# Altium project Longboard_32bit_ext.PrjPCB (part 5 of 6)

## Sheet Relay_Driver.SchDoc: Sienci Longboard Ext
size B; Author: AM; CompanyName: Expatria Technologies; DrawnBy: A.Marles; Engineer: AM; Organization: Expatria Technolgoies; Address1: PO Box 2084; Address3: Merritt, BC V1K 1B8; Address4: Canada; DocumentNumber: 10; Revision: B9; SheetNumber: 10; SheetTotal: 27
Used 2 times, as channels Sienci CNC Controller/Additional IO/RL1, Sienci CNC Controller/Additional IO/RL2. Parts and nets are listed once, with the designators drawn on the sheet.
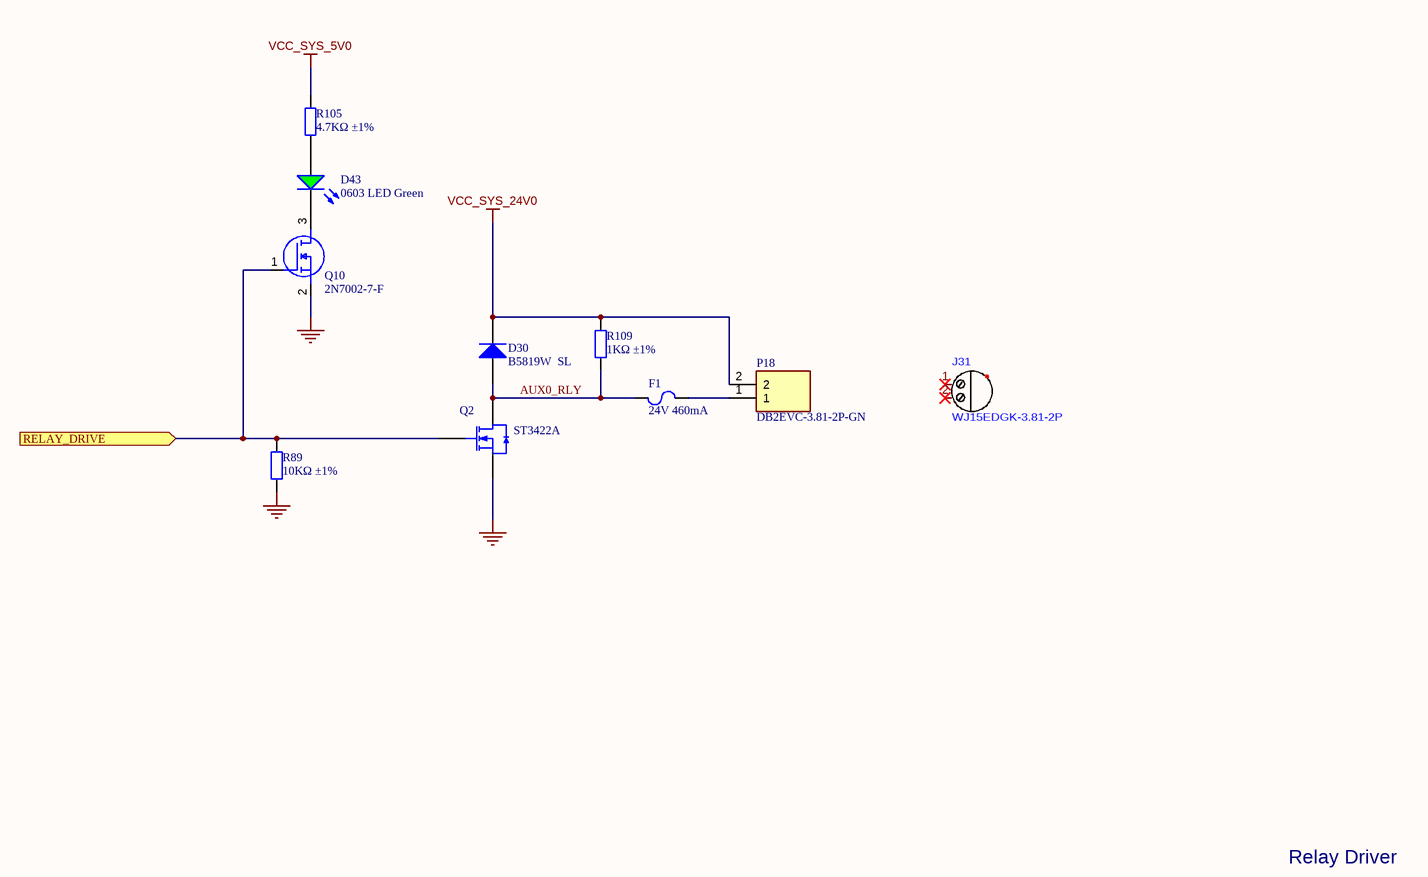
[diagram p18: Relay_Driver.SchDoc]

### Parts
D30  B5819W  SL  [SOD-123]
D43  0603 LED Green  [0603_LED_S1 - GREEN]
F1  24V 460mA  [1206_C]
J31  WJ15EDGK-3.81-2P  (mechanical)
P18  DB2EVC-3.81-2P-GN  [CONN-TH_5P-P3.81_DB2EVC-3.81-2p]
Q2  ST3422A  [SOT-23-3L]
Q10  2N7002-7-F  [SOT-23(SOT-23-3)]
R89  10KΩ ±1%  [0402_R]
R105  4.7KΩ ±1%  [0402_R]
R109  1KΩ ±1%  [0603_R]

### Ports
RELAY_DRIVE (in)

### Nets
GND: Q2.2(S) Q10.2(S) R89.1
VCC_SYS_5V0: R105.2
VCC_SYS_24V0: D30.2(K) P18.2 R109.2
AUX0_RLY: D30.1(A) F1.2 Q2.3(D) R109.1
RELAY_DRIVE: Q2.1(G) Q10.1(G) R89.2 ; port RELAY_DRIVE
NetD43_A: D43.A R105.1
NetD43_K: D43.K Q10.3(D)
NetF1_1: F1.1 P18.1

Not connected (* = marked no-connect by the designer): J31 1* 2*

### Channels
Sienci CNC Controller/Additional IO/RL1: designators end in _RL1; ports RELAY_DRIVE=AUX_OUT_0_5V
Sienci CNC Controller/Additional IO/RL2: designators end in _RL2; ports RELAY_DRIVE=AUX_OUT_1_5V

### Notes on the sheet
- Relay Driver
- SHEET
- Expatria Technologies
- 625 Kane Valley Rd.
- Box 2084
- Merritt, BC V1K1B8
- PROJECT
- SIZE
- ENGR
- MODIFIED
- DOCUMENT
- REV
- Copyright Sienci Labs 2024. This document describes Open Hardware and is licensed under the CERN-OHL-S v2. No warranty is implied or expressed.
- EMAIL: INFO@EXPATRIA.CA
- B
- /

### Library data of the parts
D30 = B5819W  SL: 40V 600mV@1A 1A SOD-123 Schottky Barrier Diodes (SBD) ROHS; Manufacturer: Jiangsu Changjing Electronics Technology Co., Ltd.; ComponentLink1Description: 供应商链接; ComponentLink1URL: http://www.szlcsc.com/product/details_9093.html; Package: SOD-123; Supplier: LC; SuppliersPartNumber: C8598; Manufacturer Part Number: B5819W SL
D43 = MHT192UGCT: 20mA -40℃~+85℃ 515nm~530nm Emerald 120° 60mW 0603 Light Emitting Diodes (LED) ROHS; Manufacturer: MEIHUA; Package: 0603; Supplier: LC; SuppliersPartNumber: C389519; Color: Green; Manufacturer Part Number: MHT192UGCT
F1 = JK-nSMD050-24: 24V 200mA 100A 460mA - Resettable Fuses ROHS; Manufacturer: Jinrui Electronic Materials Co.; PartNumber: JK-nSMD020-24; Package: 1206; Supplier: LC; SuppliersPartNumber: C5307785
J31 = WJ15EDGK-3.81-2P: 2 1 3.81mm Green Plug P=3.81mm Pluggable System Terminal Block ROHS; Manufacturer: Ningbo; Supplier: LCSC; Supplier Part Number 1: C8466; Manufacturer Part Number: WJ15EDGK-3.81-2P; RoHS: Yes; SuppliersPartNumber: C8466
P18 = DB2EVC-3.81-2P-GN: as P1-P4 on sheet Stepper_driver_group; SuppliersPartNumber: C395686; Manufacturer Part Number: DB2EVC-3.81-2P-GN; Supplier: LCSC; Value: DB2EVC-3.81-2P-GN
Q2 = ST3422A: 60V 6A 28mΩ@10V,6A 2W 3V@250uA 38pF@15V N Channel 455pF@15V 10nC@10V -55℃~+150℃@(Tj) SOT-23-3L MOSFETs ROHS; Manufacturer: STANSON Tech.; Package: SOT-23; Supplier: LCSC; SuppliersPartNumber: C2682907; Manufacturer Part Number: ST3422A; Value: ST3422A
Q10 = 2N7002-7-F: 60V 115mA 7.5Ω@5V,50mA 370mW N Channel SOT-23 MOSFETs ROHS; Manufacturer: Diodes Inc.; SuppliersPartNumber: C85049; Manufacturer Part Number: 2N7002-7-F; Value: 2N7002-7-F; Datasheet Link: https://datasheet.datasheetarchive.com/originals/distributors/SFDatasheet-0/sf-0003625.pdf; Height: 1.2mm; Manufacturer_Part_Number: 2N7002-7-F; Mouser Part Number: 621-2N7002-F; Mouser Price/Stock: https://www.mouser.co.uk/ProductDetail/Diodes-Incorporated/2N7002-7-F?qs=jMXWnm70%252BC%252BAX%252BMLzUkTZg%3D%3D; Arrow Part Number: 2N7002-7-F; Arrow Price/Stock: https://www.arrow.com/en/products/2n7002-7-f/diodes-incorporated?region=nac
R89 = 0402 10K (1002) 1%: Chip resistor; Manufacturer: Uniroyal Elec; Manufacturer Part Number: 0402WGF1002TCE; Power: 1/16W; ComponentLink1Description: Supplier link; ComponentLink1URL: http://www.szlcsc.com/product/details_26487.html; Package: 0402; Supplier: LC; SuppliersPartNumber: C25744; Resistance: 10KΩ; Tolerance: 1%
R105 = 0402 4.7K (4701) 1%: Chip resistor; Manufacturer: Uniroyal Elec; Manufacturer Part Number: 0402WGF4701TCE; Power: 1/16W; ComponentLink1Description: Supplier link; ComponentLink1URL: http://www.szlcsc.com/product/details_26643.html; Package: 0402; Supplier: LC; SuppliersPartNumber: C25900; Resistance: 4.7KΩ; Tolerance: 1%
R109 = 0603 1K (1001) 1%: Chip resistor; Manufacturer: Uniroyal Elec; Manufacturer Part Number: 0603WAF1001T5E; Power: 1/10W; ComponentLink1Description: Supplier link; ComponentLink1URL: http://www.szlcsc.com/product/details_21904.html; Package: 0603; Supplier: LC; SuppliersPartNumber: C21190; Resistance: 1KΩ; Tolerance: 1%

## Sheet Neopixel_Driver.SchDoc: Sienci Longboard Ext
size B; Author: AM; CompanyName: Expatria Technologies; DrawnBy: A.Marles; Engineer: AM; Organization: Expatria Technolgoies; Address1: PO Box 2084; Address3: Merritt, BC V1K 1B8; Address4: Canada; DocumentNumber: 11; Revision: B9; SheetNumber: 11; SheetTotal: 27
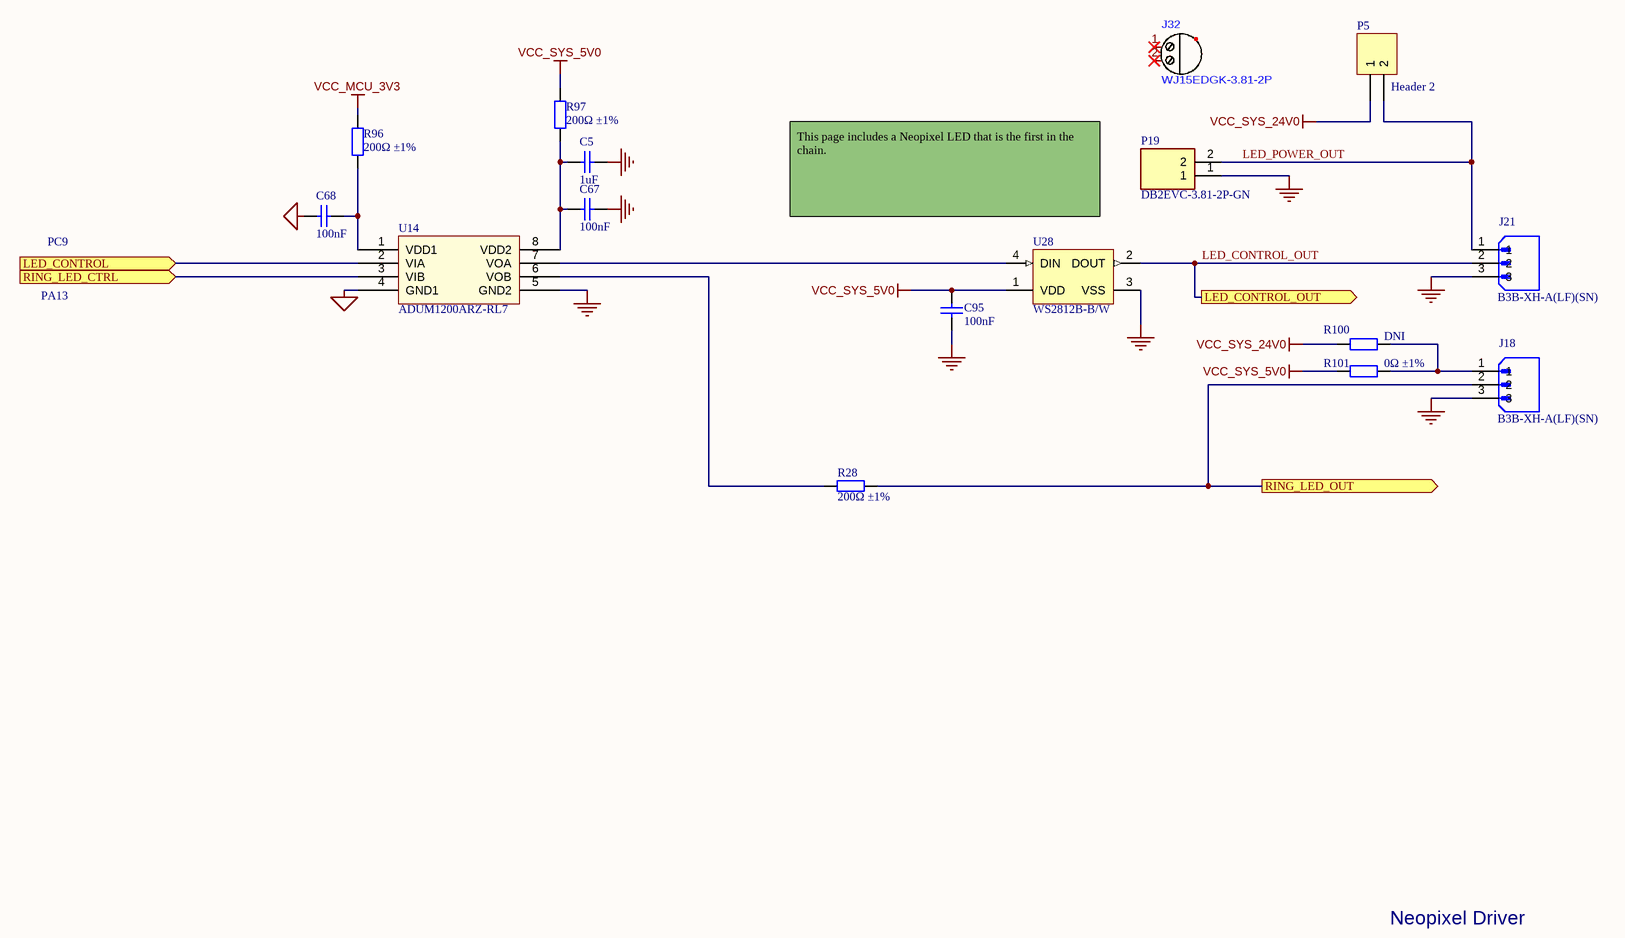
[diagram p19: Neopixel_Driver.SchDoc]

### Parts
C5  1uF  [0603_C]
C67  100nF  [0603_C]
C68  100nF  [0603_C]
C95  100nF  [0603_C]
J18  B3B-XH-A(LF)(SN)  [JST_B3B-XH-A(LF)(SN)]
J21  B3B-XH-A(LF)(SN)  [JST_B3B-XH-A(LF)(SN)]
J32  WJ15EDGK-3.81-2P  (mechanical)
P5  Header 2  [HDR1X2]
P19  DB2EVC-3.81-2P-GN  [CONN-TH_5P-P3.81_DB2EVC-3.81-2p]
R28  200Ω ±1%  [0402_R]
R96  200Ω ±1%  [0402_R]
R97  200Ω ±1%  [0402_R]
R100  DNI  [0603_R]
R101  0Ω ±1%  [0603_R]
U14  ADUM1200ARZ-RL7  [SOIC-8_150mil]
U28  WS2812B-B/W  [ADA-RGB-1655_V]

### Ports
LED_CONTROL (in), LED_CONTROL_OUT (out), RING_LED_CTRL (in), RING_LED_OUT (out)

### Nets
GND: C5.1 C67.1 C95.1 J18.3 J21.3 P19.1 U14.5(GND2) U28.3(VSS)
MCU_GND: C68.2 U14.4(GND1)
VCC_MCU_3V3: R96.2
VCC_SYS_5V0: C95.2 R97.2 R101.2 U28.1(VDD)
VCC_SYS_24V0: P5.1 R100.2
LED Control: U14.2(VIA) ; port LED_CONTROL
LED_CONTROL_OUT: J21.2 U28.2(DOUT) ; port LED_CONTROL_OUT
LED_POWER_OUT: J21.1 P5.2 P19.2
RING_LED_OUT: J18.2 R28.1 ; port RING_LED_OUT
SWDIO: U14.3(VIB) ; port RING_LED_CTRL
NetC5_2: C5.2 C67.2 R97.1 U14.8(VDD2)
NetC68_1: C68.1 R96.1 U14.1(VDD1)
NetJ18_1: J18.1 R100.1 R101.1
NetR28_2: R28.2 U14.6(VOB)
NetU14_7: U14.7(VOA) U28.4(DIN)

Not connected (* = marked no-connect by the designer): J32 1* 2*

### Notes on the sheet
- PC9
- (near U28) This page includes a Neopixel LED that is the first in the chain.
- PA13
- Neopixel Driver
- SHEET
- Expatria Technologies
- 625 Kane Valley Rd.
- Box 2084
- Merritt, BC V1K1B8
- PROJECT
- SIZE
- ENGR
- MODIFIED
- DOCUMENT
- REV
- Copyright Sienci Labs 2024. This document describes Open Hardware and is licensed under the CERN-OHL-S v2. No warranty is implied or expressed.
- EMAIL: INFO@EXPATRIA.CA
- B
- /

### Library data of the parts
C5 = 0603 1uF (105) 10% 50V: Chip capacitors; Manufacturer: Samsung Electro-Mechanics; Manufacturer Part Number: CL10A105KB8NNNC; Tolerance: 10%; Voltage: 50V; Package: 0603; Supplier: LC; SuppliersPartNumber: C15849; Capacitance: 1uF; Manufacturer 1: Samsung Electro-Mechanics
C67 C68 C95 = 0603 100nF (104) 10% 50V: 50V 100nF X7R ±10% 0603 Multilayer Ceramic Capacitors MLCC - SMD/SMT ROHS; Manufacturer: YAGEO; Manufacturer Part Number: CC0603KRX7R9BB104; ComponentLink1Description: Supplier link; ComponentLink1URL: http://www.szlcsc.com/product/details_15331.html; Package: 0603; Supplier: LC; SuppliersPartNumber: C14663; Capacitance: 100nF; Tolerance: 10%; Voltage: 50V
J18 J21 = B3B-XH-A(LF)(SN): Connector Header Through Hole 3 position 0.098" (2.50mm); Manufacturer: JST Sales America; Manufacturer Part Number: B3B-XH-A(LF)(SN); SuppliersPartNumber: C144394; MP: B3B-XH-A(LF)(SN); Value: B3B-XH-A(LF)(SN); Supplier: LCSC
J32 = WJ15EDGK-3.81-2P: as J31 on sheet Relay_Driver; Supplier: LCSC; Supplier Part Number 1: C8466; Manufacturer Part Number: WJ15EDGK-3.81-2P; RoHS: Yes; SuppliersPartNumber: C8466
P5 = Header 2: Straight Square Pins 2 2.54mm Black Brass 1x2P Plugin,P=2.54mm Pin Headers ROHS; Manufacturer: MOLEX; Manufacturer Part Number: 22284020; Publisher: Altium Limited; LatestRevisionDate: 17-Jul-2002; LatestRevisionNote: Re-released for DXP Platform.; SuppliersPartNumber: C234182; Supplier 1: LCSC; Supplier Part Number 1: C234182
P19 = DB2EVC-3.81-2P-GN: as P1-P4 on sheet Stepper_driver_group; SuppliersPartNumber: C395686; Manufacturer Part Number: DB2EVC-3.81-2P-GN; Supplier: LCSC; Value: DB2EVC-3.81-2P-GN
R28 R96 R97 = 0402 200R (2000) 1%: Chip resistor; Manufacturer: Uniroyal Elec; Manufacturer Part Number: 0402WGF2000TCE; Power: 1/16W; ComponentLink1Description: Supplier link; ComponentLink1URL: http://www.szlcsc.com/product/details_25830.html; Package: 0402; Supplier: LC; SuppliersPartNumber: C25087; Resistance: 200Ω; Tolerance: 1%
R100 = 0603 0R (0R0) 1%: Chip resistor; Manufacturer: Uniroyal Elec; Manufacturer Part Number: 0603WAF0000T5E; Power: 1/10W; Resistance: 0Ω; Tolerance: 1%; ComponentLink1Description: Supplier link; ComponentLink1URL: http://www.szlcsc.com/product/details_21903.html; Package: 0603; Supplier: LC; SuppliersPartNumber: C21189
R101 = 0603 0R (0R0) 1%: Chip resistor; Manufacturer: Uniroyal Elec; Manufacturer Part Number: 0603WAF0000T5E; Power: 1/10W; ComponentLink1Description: Supplier link; ComponentLink1URL: http://www.szlcsc.com/product/details_21903.html; Package: 0603; Supplier: LC; SuppliersPartNumber: C21189; Resistance: 0Ω; Tolerance: 1%
U14 = ADUM1200ARZ-RL7: Dual Channel Isolator; Manufacturer: Analog Devices; Package: SOIC-8_150mil; Supplier: LC; SuppliersPartNumber: C15219; ComponentLink1Description: 供应商链接; ComponentLink1URL: http://www.szlcsc.com/product/details_10199.html; Manufacturer Part Number: ADUM1200ARZ-RL7
U28 = WS2812B-B/W: Intelligent Control LED Integrated Light Source, 3.5 to 5.3 V, -25 to 80 degC, 4-Pin SMD, RoHS, Tape and Reel; Manufacturer: Worldsemi; Manufacturer 1: Adafruit Industries; Manufacturer Part Number 1: 1655; Package Description: 4-Pin Surface Mount Device, Body 5 x 5 mm; SuppliersPartNumber: C2761795; Manufacturer Part Number: WS2812B-B/W; Supplier: LCSC

## Sheet Transistor_Driver.SchDoc: Sienci Longboard Ext
size B; Author: AM; CompanyName: Expatria Technologies; DrawnBy: A.Marles; Engineer: AM; Organization: Expatria Technolgoies; Address1: PO Box 2084; Address3: Merritt, BC V1K 1B8; Address4: Canada; DocumentNumber: 15; Revision: B9; SheetNumber: 15; SheetTotal: 27
Used 2 times, as channels Sienci CNC Controller/Additional IO/TR1, Sienci CNC Controller/Additional IO/TR2. Parts and nets are listed once, with the designators drawn on the sheet.
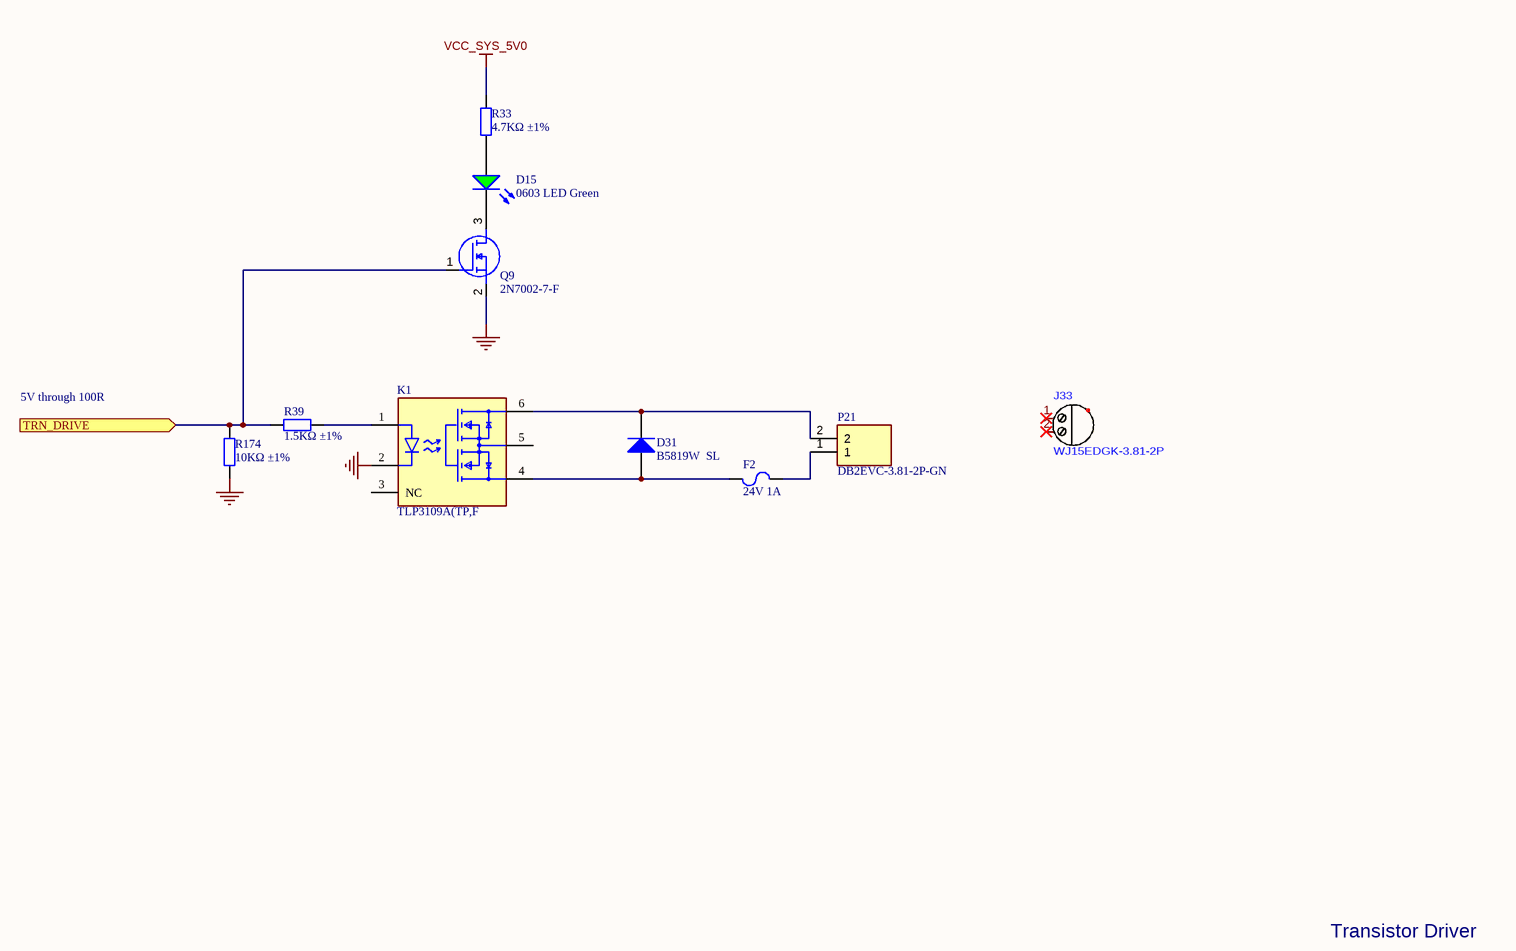
[diagram p20: Transistor_Driver.SchDoc]

### Parts
D15  0603 LED Green  [0603_LED_S1 - GREEN]
D31  B5819W  SL  [SOD-123]
F2  24V 1A  [1206_C]
J33  WJ15EDGK-3.81-2P  (mechanical)
K1  TLP3109A(TP,F  [FP-11-7C1S-MFG]
P21  DB2EVC-3.81-2P-GN  [CONN-TH_5P-P3.81_DB2EVC-3.81-2p]
Q9  2N7002-7-F  [SOT-23(SOT-23-3)]
R33  4.7KΩ ±1%  [0402_R]
R39  1.5KΩ ±1%  [0402_R]
R174  10KΩ ±1%  [0402_R]

### Ports
TRN_DRIVE (in)

### Nets
GND: K1.2(C) Q9.2(S) R174.1
VCC_SYS_5V0: R33.2
TRN_DRIVE: Q9.1(G) R39.1 R174.2 ; port TRN_DRIVE
NetD15_A: D15.A R33.1
NetD15_K: D15.K Q9.3(D)
NetD31_1: D31.1(A) F2.1 K1.4(Drain)
NetD31_2: D31.2(K) K1.6(Drain) P21.2
NetF2_2: F2.2 P21.1
NetK1_1: K1.1(A) R39.2

Not connected (* = marked no-connect by the designer): J33 1* 2*; K1 3(NC) 5(Source)

### Channels
Sienci CNC Controller/Additional IO/TR1: designators end in _TR1; ports TRN_DRIVE=AUX_OUT_2_5V
Sienci CNC Controller/Additional IO/TR2: designators end in _TR2; ports TRN_DRIVE=AUX_OUT_3_5V

### Notes on the sheet
- 5V through 100R
- Transistor Driver
- SHEET
- Expatria Technologies
- 625 Kane Valley Rd.
- Box 2084
- Merritt, BC V1K1B8
- PROJECT
- SIZE
- ENGR
- MODIFIED
- DOCUMENT
- REV
- Copyright Sienci Labs 2024. This document describes Open Hardware and is licensed under the CERN-OHL-S v2. No warranty is implied or expressed.
- EMAIL: INFO@EXPATRIA.CA
- B
- /

### Library data of the parts
D15 = MHT192UGCT: as D43 on sheet Relay_Driver; Package: 0603; Supplier: LC; SuppliersPartNumber: C389519; Color: Green; Manufacturer Part Number: MHT192UGCT
D31 = B5819W  SL: as D30 on sheet Relay_Driver; ComponentLink1Description: 供应商链接; ComponentLink1URL: http://www.szlcsc.com/product/details_9093.html; Package: SOD-123; Supplier: LC; SuppliersPartNumber: C8598; Manufacturer Part Number: B5819W SL
F2 = JK-nSMD050-24: 24V 1A 0.1s 1206 PTC Resettable Fuses RoHS; Manufacturer: Jinrui Electronic Materials Co.; Package: 1206; Supplier: LC; SuppliersPartNumber: C369160; PartNumber: JK-nSMD050-24
J33 = WJ15EDGK-3.81-2P: as J31 on sheet Relay_Driver; Supplier: LCSC; Supplier Part Number 1: C8466; Manufacturer Part Number: WJ15EDGK-3.81-2P; RoHS: Yes; SuppliersPartNumber: C8466
K1 = TLP3109A(TP,F: Relay SSR 10mA 1.8V DC-IN 3A 100V DC-OUT 6-Pin 11-7C1S Emboss T/R; Manufacturer: Toshiba; Manufacturer Part Number: TLP3109A(TP,F; SuppliersPartNumber: C1857559; Supplier: LC; Supplier 1: Digikey; Supplier Part Number 1: 264-TLP3109A(TPFCT-ND; RoHS: No; Category: Solid State Relays
P21 = DB2EVC-3.81-2P-GN: as P1-P4 on sheet Stepper_driver_group; SuppliersPartNumber: C395686; Manufacturer Part Number: DB2EVC-3.81-2P-GN; Supplier: LCSC; Value: DB2EVC-3.81-2P-GN
Q9 = 2N7002-7-F: as Q10 on sheet Relay_Driver; SuppliersPartNumber: C85049; Manufacturer Part Number: 2N7002-7-F; Value: 2N7002-7-F; Datasheet Link: https://datasheet.datasheetarchive.com/originals/distributors/SFDatasheet-0/sf-0003625.pdf; Height: 1.2mm; Manufacturer_Part_Number: 2N7002-7-F; Mouser Part Number: 621-2N7002-F; Mouser Price/Stock: https://www.mouser.co.uk/ProductDetail/Diodes-Incorporated/2N7002-7-F?qs=jMXWnm70%252BC%252BAX%252BMLzUkTZg%3D%3D; Arrow Part Number: 2N7002-7-F; Arrow Price/Stock: https://www.arrow.com/en/products/2n7002-7-f/diodes-incorporated?region=nac
R33 = 0402 4.7K (4701) 1%: as R105 on sheet Relay_Driver; ComponentLink1Description: Supplier link; ComponentLink1URL: http://www.szlcsc.com/product/details_26643.html; Package: 0402; Supplier: LC; SuppliersPartNumber: C25900; Resistance: 4.7KΩ; Tolerance: 1%
R39 = 0402 1.5K (1501) 1%: Chip resistor; Manufacturer: Uniroyal Elec; Manufacturer Part Number: 0402WGF1501TCE; Power: 1/16W; ComponentLink1Description: Supplier link; ComponentLink1URL: http://www.szlcsc.com/product/details_26610.html; Package: 0402; Supplier: LC; SuppliersPartNumber: C25867; Resistance: 1.5KΩ; Tolerance: 1%
R174 = 0402 10K (1002) 1%: as R89 on sheet Relay_Driver; ComponentLink1Description: Supplier link; ComponentLink1URL: http://www.szlcsc.com/product/details_26487.html; Package: 0402; Supplier: LC; SuppliersPartNumber: C25744; Resistance: 10KΩ; Tolerance: 1%

## Sheet External_Stepper.SchDoc: Sienci Longboard Ext
size B; Author: AM; CompanyName: Expatria Technologies; DrawnBy: A.Marles; Engineer: AM; Organization: Expatria Technolgoies; Address1: PO Box 2084; Address3: Merritt, BC V1K 1B8; Address4: Canada; DocumentNumber: 12; Revision: B9; SheetNumber: 12; SheetTotal: 27
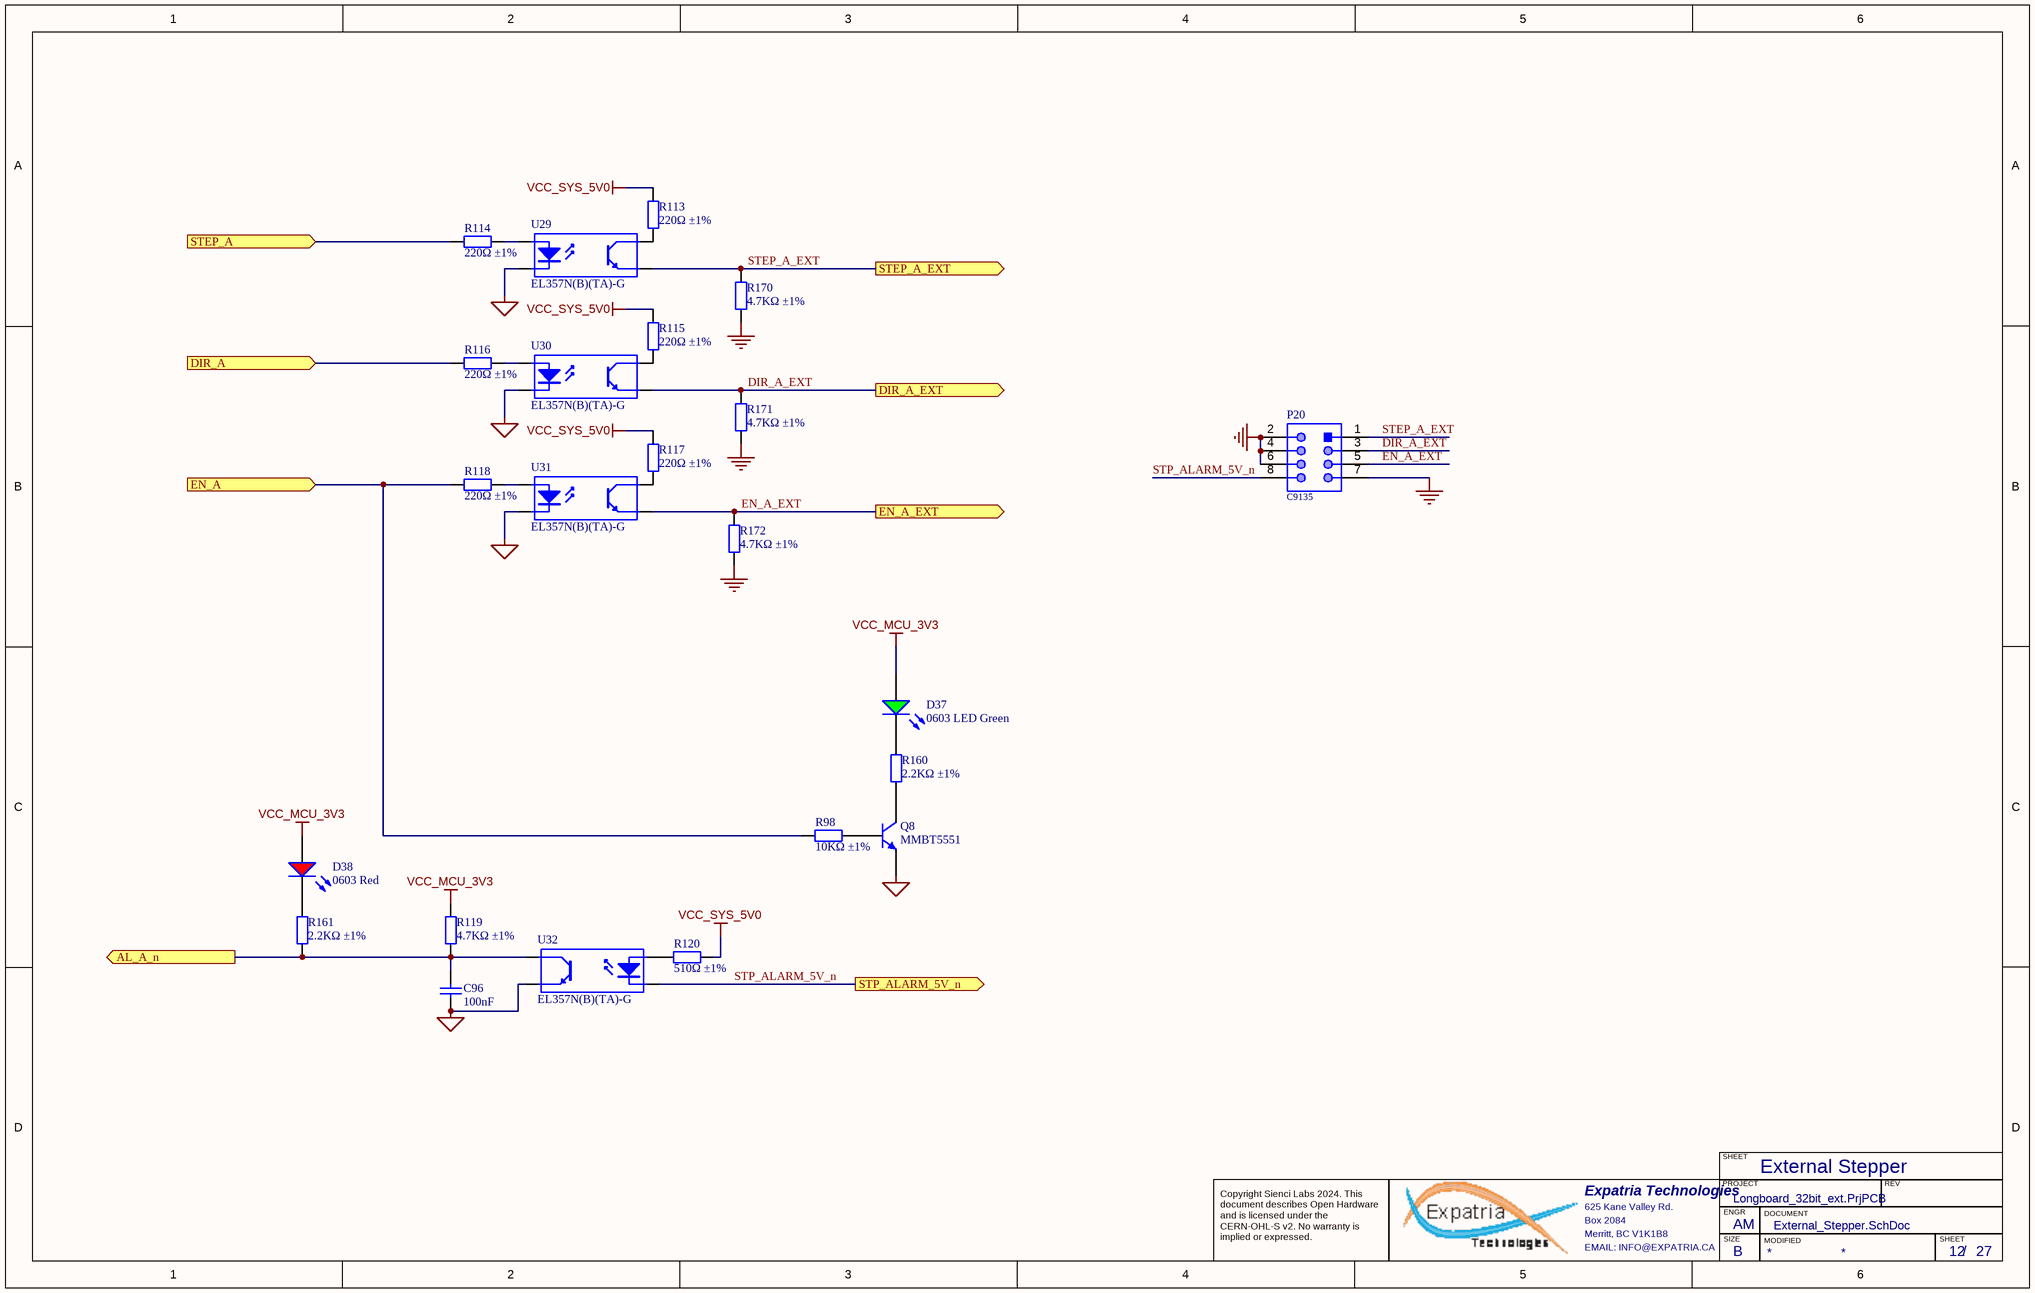
[diagram p21: External_Stepper.SchDoc]

### Parts
C96  100nF  [0402_C]
D37  0603 LED Green  [0603_LED_S1 - GREEN]
D38  0603 Red  [0603_LED_S1]
P20  C9135  [61200821621]
Q8  MMBT5551  [SOT-23(SOT-23-3)]
R98  10KΩ ±1%  [0603_R]
R113  220Ω ±1%  [0402_R]
R114  220Ω ±1%  [0402_R]
R115  220Ω ±1%  [0402_R]
R116  220Ω ±1%  [0402_R]
R117  220Ω ±1%  [0402_R]
R118  220Ω ±1%  [0402_R]
R119  4.7KΩ ±1%  [0402_R]
R120  510Ω ±1%  [0402_R]
R160  2.2KΩ ±1%  [0402_R]
R161  2.2KΩ ±1%  [0402_R]
R170  4.7KΩ ±1%  [0402_R]
R171  4.7KΩ ±1%  [0402_R]
R172  4.7KΩ ±1%  [0402_R]
U29  EL357N(B)(TA)-G  [SOP-4_P2.54]
U30  EL357N(B)(TA)-G  [SOP-4_P2.54]
U31  EL357N(B)(TA)-G  [SOP-4_P2.54]
U32  EL357N(B)(TA)-G  [SOP-4_P2.54]

### Ports
AL_A_n (out), DIR_A (in), DIR_A_EXT (out), EN_A (in), EN_A_EXT (out), STEP_A (in), STEP_A_EXT (out), STP_ALARM_5V_n (out)

### Nets
GND: P20.2 P20.4 P20.6 P20.7 R170.2 R171.2 R172.2
MCU_GND: C96.1 Q8.2(E) U29.2(K) U30.2(K) U31.2(K) U32.3(E)
VCC_MCU_3V3: D37.A D38.A R119.2
VCC_SYS_5V0: R113.1 R115.1 R117.1 R120.2
AL_A: C96.2 R119.1 R161.1 U32.4(C) ; port AL_A_n
DIR_A: R116.1 ; port DIR_A
DIR_A_EXT: P20.3 R171.1 U30.3(E) ; port DIR_A_EXT
EN_A_EXT: P20.5 R172.1 U31.3(E) ; port EN_A_EXT
STEP_A: R114.1 ; port STEP_A
STEP_A_EXT: P20.1 R170.1 U29.3(E) ; port STEP_A_EXT
STEP_EN_A: R98.2 R118.1 ; port EN_A
STP_ALARM_5V_n: P20.8 U32.2(K) ; port STP_ALARM_5V_n
NetD37_K: D37.K R160.2
NetD38_K: D38.K R161.2
NetQ8_1: Q8.1(B) R98.1
NetQ8_3: Q8.3(C) R160.1
NetR113_2: R113.2 U29.4(C)
NetR114_2: R114.2 U29.1(A)
NetR115_2: R115.2 U30.4(C)
NetR116_2: R116.2 U30.1(A)
NetR117_2: R117.2 U31.4(C)
NetR118_2: R118.2 U31.1(A)
NetR120_1: R120.1 U32.1(A)

### Notes on the sheet
- External Stepper
- SHEET
- Expatria Technologies
- 625 Kane Valley Rd.
- Box 2084
- Merritt, BC V1K1B8
- PROJECT
- SIZE
- ENGR
- MODIFIED
- DOCUMENT
- REV
- Copyright Sienci Labs 2024. This document describes Open Hardware and is licensed under the CERN-OHL-S v2. No warranty is implied or expressed.
- EMAIL: INFO@EXPATRIA.CA
- B
- /

### Library data of the parts
C96 = 0402 100nF (104) 10% 16V: 16V 100nF X7R ±10% 0402 Multilayer Ceramic Capacitors MLCC - SMD/SMT ROHS; Manufacturer: Samsung Electro-Mechanics; Manufacturer Part Number: CL05B104KO5NNNC; ComponentLink1Description: Supplier link; ComponentLink1URL: http://www.szlcsc.com/product/details_1877.html; Package: 0402; Supplier: LC; SuppliersPartNumber: C1525; Capacitance: 100nF; Tolerance: 10%; Voltage: 16V
D37 = MHT192UGCT: as D43 on sheet Relay_Driver; Package: 0603; Supplier: LC; SuppliersPartNumber: C389519; Color: Green; Manufacturer Part Number: MHT192UGCT
D38 = KT-0603R: as D61-D64 on sheet Stepper_driver_group; Package: 0603; Supplier: LC; SuppliersPartNumber: C2286; Color: Red; Manufacturer Part Number: KT-0603R; Value: 0603 Red
P20 = HDR2x4P: Male Box Header WR-BHD, THT, Vertical, pitch 2.54 mm, 8 pins; Manufacturer: Wurth Electronics; Pitch: 2.54mm; Publisher: WurthElektronik; Manufacturer Part Number: C9135; Packaging: Tray; Published Date: August2018; Manufacturer Part Number: 61200821621; SuppliersPartNumber: C9135; Supplier: LCSC
Q8 = MMBT5551: 50nA 160V 300mW 200@10mA,5V 600mA 100MHz 200mV@50mA,5mA NPN +150℃@(Tj) SOT-23-3 Bipolar Transistors - BJT ROHS; Manufacturer: Jiangsu Changjing Electronics Technology; Package: SOT-23; Supplier: LCSC; SuppliersPartNumber: C2145; Manufacturer Part Number: MMBT5551; Value: MMBT5551
R98 = 0603 10K (1002) 1%: Chip resistor; Manufacturer: Uniroyal Elec; Manufacturer Part Number: 0603WAF1002T5E; Power: 1/10W; Package: 0603; Supplier: LC; SuppliersPartNumber: C25804; Resistance: 10KΩ; Tolerance: 1%; ComponentLink1Description: Supplier link; ComponentLink1URL: http://www.szlcsc.com/product/details_26547.html
R113-R118 = 0402 220R (2200) 1%: Chip resistor; Manufacturer: Uniroyal Elec; Manufacturer Part Number: 0402WGF2200TCE; Power: 1/16W; Package: 0402; Supplier: LC; SuppliersPartNumber: C25091; Resistance: 220Ω; Tolerance: 1%; ComponentLink1Description: Supplier link; ComponentLink1URL: http://www.szlcsc.com/product/details_25834.html
R119 R170-R172 = 0402 4.7K (4701) 1%: as R105 on sheet Relay_Driver; ComponentLink1Description: Supplier link; ComponentLink1URL: http://www.szlcsc.com/product/details_26643.html; Package: 0402; Supplier: LC; SuppliersPartNumber: C25900; Resistance: 4.7KΩ; Tolerance: 1%
R120 = 0402 510R (5100) 1%: Chip resistor; Manufacturer: Uniroyal Elec; Manufacturer Part Number: 0402WGF5100TCE; Power: 1/16W; ComponentLink1Description: Supplier link; ComponentLink1URL: http://www.szlcsc.com/product/details_25866.html; Package: 0402; Supplier: LC; SuppliersPartNumber: C25123; Resistance: 510Ω; Tolerance: 1%
R160 R161 = 0402 2.2K (2201) 1%: as R185-R188 on sheet Stepper_driver_group; ComponentLink1Description: Supplier link; ComponentLink1URL: http://www.szlcsc.com/product/details_26622.html; Package: 0402; Supplier: LC; SuppliersPartNumber: C25879; Resistance: 2.2KΩ; Tolerance: 1%
U29-U32 = EL357N(B)(TA)-G_[C6649]: Optocoupler SOP-4, EL357N(B)(TA)-G, Everlight Electronics; Package: SOP-4_P2.54; Supplier: LC; SuppliersPartNumber: C6649; Manufacturer: Everlight; Manufacturer Part Number: EL357N(B)(TA)-G

## Sheet 5V_Digital_Out.SchDoc: Sienci Longboard Ext
size B; Author: AM; CompanyName: Expatria Technologies; DrawnBy: A.Marles; Engineer: AM; Organization: Expatria Technolgoies; Address1: PO Box 2084; Address3: Merritt, BC V1K 1B8; Address4: Canada; DocumentNumber: 13; Revision: B9; SheetNumber: 13; SheetTotal: 27
Used 6 times, as channels Sienci CNC Controller/Additional IO/AO0, Sienci CNC Controller/Additional IO/AO1, Sienci CNC Controller/Additional IO/AO2, Sienci CNC Controller/Additional IO/AO3, Sienci CNC Controller/Additional IO/COO, Sienci CNC Controller/Additional IO/MIS. Parts and nets are listed once, with the designators drawn on the sheet.
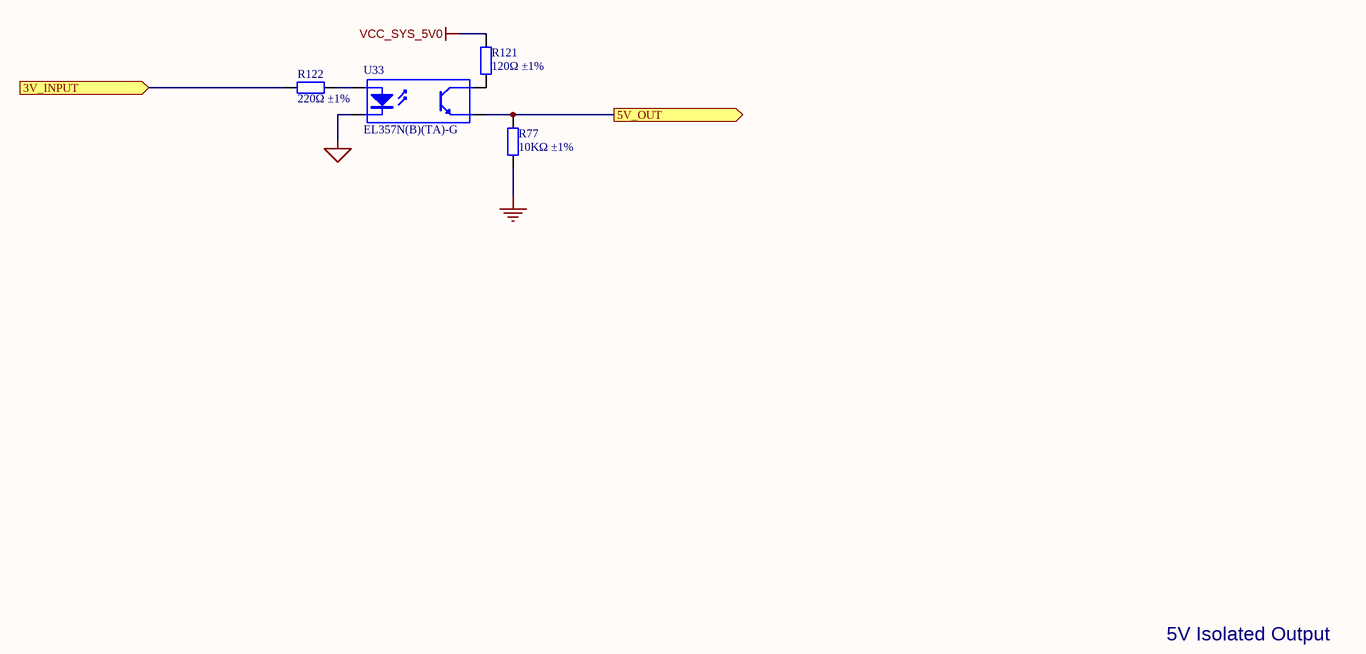
[diagram p22: 5V_Digital_Out.SchDoc]

### Parts
R77  10KΩ ±1%  [0402_R]
R121  120Ω ±1%  [0402_R]
R122  220Ω ±1%  [0402_R]
U33  EL357N(B)(TA)-G  [SOP-4_P2.54]

### Ports
3V_INPUT (in), 5V_OUT (out)

### Nets
GND: R77.1
MCU_GND: U33.2(K)
VCC_SYS_5V0: R121.1
3V_INPUT: R122.1 ; port 3V_INPUT
5V_OUT: R77.2 U33.3(E) ; port 5V_OUT
NetR121_2: R121.2 U33.4(C)
NetR122_2: R122.2 U33.1(A)

### Channels
Sienci CNC Controller/Additional IO/AO0: designators end in _AO0; ports 3V_INPUT=AUXOUT_0 5V_OUT=AUX_OUT_0_5V
Sienci CNC Controller/Additional IO/AO1: designators end in _AO1; ports 3V_INPUT=AUXOUT_1 5V_OUT=AUX_OUT_1_5V
Sienci CNC Controller/Additional IO/AO2: designators end in _AO2; ports 3V_INPUT=AUXOUT_2 5V_OUT=AUX_OUT_2_5V
Sienci CNC Controller/Additional IO/AO3: designators end in _AO3; ports 3V_INPUT=AUXOUT_3 5V_OUT=AUX_OUT_3_5V
Sienci CNC Controller/Additional IO/COO: designators end in _COO; ports 3V_INPUT=COOLANT 5V_OUT=COOLANT_5V
Sienci CNC Controller/Additional IO/MIS: designators end in _MIS; ports 3V_INPUT=MIST 5V_OUT=MIST_5V

### Notes on the sheet
- 5V Isolated Output
- SHEET
- Expatria Technologies
- 625 Kane Valley Rd.
- Box 2084
- Merritt, BC V1K1B8
- PROJECT
- SIZE
- ENGR
- MODIFIED
- DOCUMENT
- REV
- Copyright Sienci Labs 2024. This document describes Open Hardware and is licensed under the CERN-OHL-S v2. No warranty is implied or expressed.
- EMAIL: INFO@EXPATRIA.CA
- B
- /

### Library data of the parts
R77 = 0402 10K (1002) 1%: as R89 on sheet Relay_Driver; ComponentLink1Description: Supplier link; ComponentLink1URL: http://www.szlcsc.com/product/details_26487.html; Package: 0402; Supplier: LC; SuppliersPartNumber: C25744; Resistance: 10KΩ; Tolerance: 1%
R121 = 0402 120R (1200) 1%: Chip resistor; Manufacturer: Uniroyal Elec; Manufacturer Part Number: 0402WGF1200TCE; Power: 1/16W; Package: 0402; Supplier: LC; SuppliersPartNumber: C25079; Resistance: 120Ω; Tolerance: 1%; ComponentLink1Description: Supplier link; ComponentLink1URL: http://www.szlcsc.com/product/details_25822.html
R122 = 0402 220R (2200) 1%: as R113-R118 on sheet External_Stepper; ComponentLink1Description: Supplier link; ComponentLink1URL: http://www.szlcsc.com/product/details_25834.html; Package: 0402; Supplier: LC; SuppliersPartNumber: C25091; Resistance: 220Ω; Tolerance: 1%
U33 = EL357N(B)(TA)-G_[C6649]: as U29 on sheet External_Stepper; Package: SOP-4_P2.54; Supplier: LC; SuppliersPartNumber: C6649; Manufacturer: Everlight; Manufacturer Part Number: EL357N(B)(TA)-G

## Sheet 3V3_Digital_Out.SchDoc: Sienci Longboard Ext
size B; Author: AM; CompanyName: Expatria Technologies; DrawnBy: A.Marles; Engineer: AM; Organization: Expatria Technolgoies; Address1: PO Box 2084; Address3: Merritt, BC V1K 1B8; Address4: Canada; DocumentNumber: 14; Revision: B9; SheetNumber: 14; SheetTotal: 27
Used 4 times, as channels Sienci CNC Controller/Additional IO/N0, Sienci CNC Controller/Additional IO/N1, Sienci CNC Controller/Additional IO/N2, Sienci CNC Controller/Additional IO/N3. Parts and nets are listed once, with the designators drawn on the sheet.
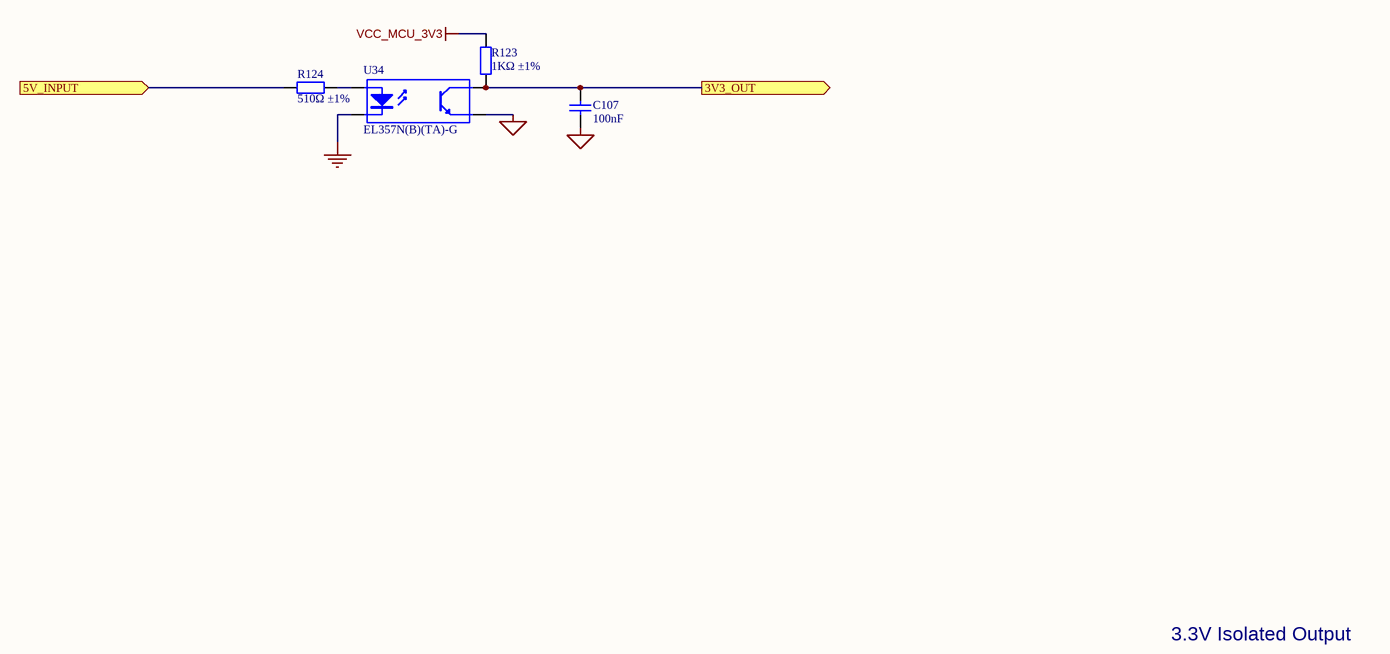
[diagram p23: 3V3_Digital_Out.SchDoc]

### Parts
C107  100nF  [0402_C]
R123  1KΩ ±1%  [0402_R]
R124  510Ω ±1%  [0402_R]
U34  EL357N(B)(TA)-G  [SOP-4_P2.54]

### Ports
3V3_OUT (out), 5V_INPUT (in)

### Nets
GND: U34.2(K)
MCU_GND: C107.1 U34.3(E)
VCC_MCU_3V3: R123.1
3V3_OUT: C107.2 R123.2 U34.4(C) ; port 3V3_OUT
5V_INPUT: R124.1 ; port 5V_INPUT
NetR124_2: R124.2 U34.1(A)

### Channels
Sienci CNC Controller/Additional IO/N0: designators end in _N0; ports 3V3_OUT=AUX_IN_0 5V_INPUT=AUX_IN0_5V
Sienci CNC Controller/Additional IO/N1: designators end in _N1; ports 3V3_OUT=AUX_IN_1 5V_INPUT=AUX_IN1_5V
Sienci CNC Controller/Additional IO/N2: designators end in _N2; ports 3V3_OUT=AUX_IN_2 5V_INPUT=AUX_IN2_5V
Sienci CNC Controller/Additional IO/N3: designators end in _N3; ports 3V3_OUT=AUX_IN_3 5V_INPUT=AUX_IN3_5V

### Notes on the sheet
- 3.3V Isolated Output
- SHEET
- Expatria Technologies
- 625 Kane Valley Rd.
- Box 2084
- Merritt, BC V1K1B8
- PROJECT
- SIZE
- ENGR
- MODIFIED
- DOCUMENT
- REV
- Copyright Sienci Labs 2024. This document describes Open Hardware and is licensed under the CERN-OHL-S v2. No warranty is implied or expressed.
- EMAIL: INFO@EXPATRIA.CA
- B
- /

### Library data of the parts
C107 = 0402 100nF (104) 10% 16V: as C96 on sheet External_Stepper; ComponentLink1Description: Supplier link; ComponentLink1URL: http://www.szlcsc.com/product/details_1877.html; Package: 0402; Supplier: LC; SuppliersPartNumber: C1525; Capacitance: 100nF; Tolerance: 10%; Voltage: 16V
R123 = 0402 1K (1001) 1%: Chip resistor; Manufacturer: Uniroyal Elec; Manufacturer Part Number: 0402WGF1001TCE; Power: 1/16W; Package: 0402; Supplier: LC; SuppliersPartNumber: C11702; Resistance: 1KΩ; Tolerance: 1%; ComponentLink1Description: Supplier link; ComponentLink1URL: http://www.szlcsc.com/product/details_12256.html
R124 = 0402 510R (5100) 1%: as R120 on sheet External_Stepper; ComponentLink1Description: Supplier link; ComponentLink1URL: http://www.szlcsc.com/product/details_25866.html; Package: 0402; Supplier: LC; SuppliersPartNumber: C25123; Resistance: 510Ω; Tolerance: 1%
U34 = EL357N(B)(TA)-G_[C6649]: as U29 on sheet External_Stepper; Package: SOP-4_P2.54; Supplier: LC; SuppliersPartNumber: C6649; Manufacturer: Everlight; Manufacturer Part Number: EL357N(B)(TA)-G

## Sheet CANBUS_Pendant.SchDoc: RP2040 CNC
size B; Author: AM; CompanyName: Expatria Technologies; DrawnBy: A.Marles; Engineer: AM; Organization: Expatria Technolgoies; Address1: PO Box 2084; Address3: Merritt, BC V1K 1B8; Address4: Canada; DocumentNumber: 24; Revision: B9; SheetNumber: 24; SheetTotal: 27
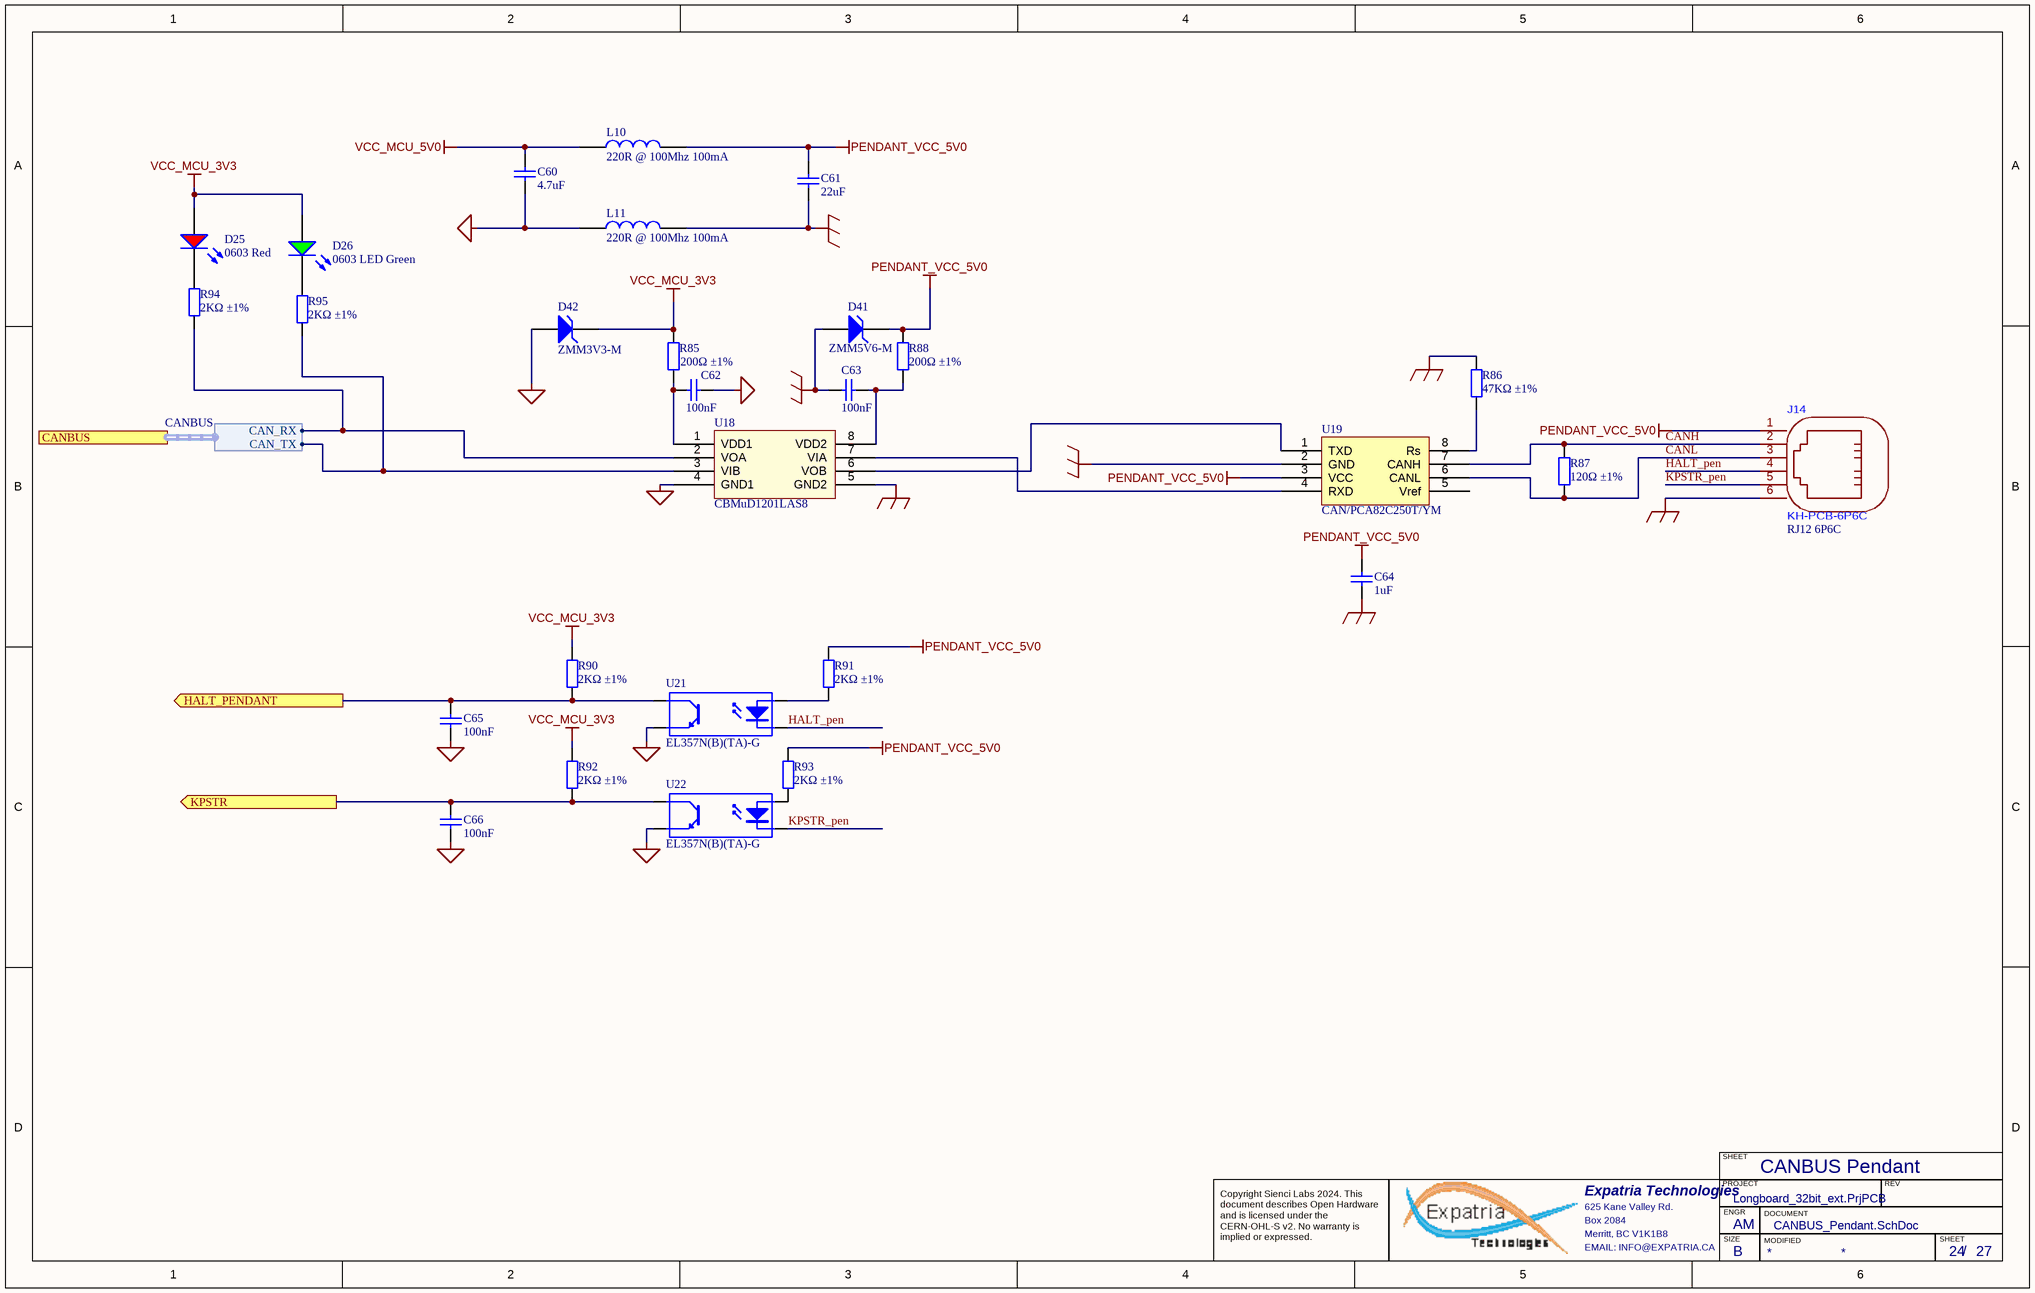
[diagram p24: CANBUS_Pendant.SchDoc]

### Parts
C60  4.7uF  [0805_C]
C61  22uF  [0805_C]
C62  100nF  [0402_C]
C63  100nF  [0402_C]
C64  1uF  [0603_C]
C65  100nF  [0603_C]
C66  100nF  [0603_C]
D25  0603 Red  [0603_LED_S1]
D26  0603 LED Green  [0603_LED_S1 - GREEN]
D41  ZMM5V6-M  [LL-34]
D42  ZMM3V3-M  [LL-34]
J14  KH-PCB-6P6C  value RJ12 6P6C  [RJ11-TH_DS1133-S60BPX]
L10  220R @ 100Mhz 100mA  [0402_L]
L11  220R @ 100Mhz 100mA  [0402_L]
R85  200Ω ±1%  [0402_R]
R86  47KΩ ±1%  [0402_R]
R87  120Ω ±1%  [0805_R]
R88  200Ω ±1%  [0402_R]
R90  2KΩ ±1%  [0402_R]
R91  2KΩ ±1%  [0402_R]
R92  2KΩ ±1%  [0402_R]
R93  2KΩ ±1%  [0402_R]
R94  2KΩ ±1%  [0402_R]
R95  2KΩ ±1%  [0402_R]
U18  CBMuD1201LAS8  [SOIC-8_150mil]
U19  CAN/PCA82C250T/YM  [SOIC-8_150mil]
U21  EL357N(B)(TA)-G  [SOP-4_P2.54]
U22  EL357N(B)(TA)-G  [SOP-4_P2.54]

### Ports
CANBUS (harness CANBUS), HALT_PENDANT (out), KPSTR (out)

### Harnesses
CANBUS: CAN_TX, CAN_RX

### Nets
MCU_GND: C60.1 C62.2 C65.1 C66.1 D42.1(A) L11.1 U18.4(GND1) U21.3(E) U22.3(E)
PEND_GND: C61.1 C63.1 C64.1 D41.1(A) J14.6(NC) L11.2 R86.2 U18.5(GND2) U19.2(GND)
PENDANT_VCC_5V0: C61.2 C64.2 D41.2(K) J14.1(MCLR) L10.2 R88.2 R91.2 R93.2 U19.3(VCC)
VCC_MCU_3V3: D25.A D26.A D42.2(K) R85.2 R90.2 R92.2
VCC_MCU_5V0: C60.2 L10.1
CAN_RX: R94.1 U18.2(VOA) ; port CANBUS.CAN_RX
CAN_TX: R95.1 U18.3(VIB) ; port CANBUS.CAN_TX
CANH: J14.2(VDD) R87.2 U19.7(CANH)
CANL: J14.3(VSS) R87.1 U19.6(CANL)
HALT_pen: J14.4(PGD) U21.2(K)
HALT_PENDANT: C65.2 R90.1 U21.4(C) ; port HALT_PENDANT
KPSTR: C66.2 R92.1 U22.4(C) ; port KPSTR
KPSTR_pen: J14.5(PGC) U22.2(K)
NetC62_1: C62.1 R85.1 U18.1(VDD1)
NetC63_2: C63.2 R88.1 U18.8(VDD2)
NetD25_K: D25.K R94.2
NetD26_K: D26.K R95.2
NetR86_1: R86.1 U19.8(Rs)
NetR91_1: R91.1 U21.1(A)
NetR93_1: R93.1 U22.1(A)
NetU18_6: U18.6(VOB) U19.1(TXD)
NetU18_7: U18.7(VIA) U19.4(RXD)

Not connected (* = marked no-connect by the designer): U19 5(Vref)

### Notes on the sheet
- CANBUS Pendant
- SHEET
- Expatria Technologies
- 625 Kane Valley Rd.
- Box 2084
- Merritt, BC V1K1B8
- PROJECT
- SIZE
- ENGR
- MODIFIED
- DOCUMENT
- REV
- Copyright Sienci Labs 2024. This document describes Open Hardware and is licensed under the CERN-OHL-S v2. No warranty is implied or expressed.
- EMAIL: INFO@EXPATRIA.CA
- B
- /

### Library data of the parts
C60 = 0805 4.7uF (475) 10% 25V: Chip capacitors; Manufacturer: Samsung Electro-Mechanics; Manufacturer Part Number: CL21A475KAQNNNE; Tolerance: 10%; Voltage: 25V; ComponentLink1Description: Supplier link; ComponentLink1URL: http://www.szlcsc.com/product/details_2131.html; Package: 0805; Supplier: LCSC; SuppliersPartNumber: C1779; Capacitance: 4.7uF
C61 = 0805 22uF (226) 20% 25V: 25V 22uF X5R ±20% 0805 Multilayer Ceramic Capacitors MLCC - SMD/SMT ROHS; Manufacturer: Samsung Electro-Mechanics; Manufacturer Part Number: CL21A226MAQNNNE; ComponentLink1Description: Supplier link; ComponentLink1URL: http://www.szlcsc.com/product/details_46786.html; Package: 0805; Supplier: LC; SuppliersPartNumber: C45783; Capacitance: 22uF; Tolerance: 20%; Voltage: 25V
C62 C63 = 0402 100nF (104) 10% 16V: as C96 on sheet External_Stepper; ComponentLink1Description: Supplier link; ComponentLink1URL: http://www.szlcsc.com/product/details_1877.html; Package: 0402; Supplier: LC; SuppliersPartNumber: C1525; Capacitance: 100nF; Tolerance: 10%; Voltage: 16V
C64 = 0603 1uF (105) 10% 50V: as C5 on sheet Neopixel_Driver; ComponentLink1Description: Supplier link; ComponentLink1URL: http://www.szlcsc.com/product/details_16531.html; Package: 0603; Supplier: LCSC; SuppliersPartNumber: C15849; Capacitance: 1uF
C65 C66 = 0603 100nF (104) 10% 50V: as C67 on sheet Neopixel_Driver; ComponentLink1Description: Supplier link; ComponentLink1URL: http://www.szlcsc.com/product/details_15331.html; Package: 0603; Supplier: LC; SuppliersPartNumber: C14663; Capacitance: 100nF; Tolerance: 10%; Voltage: 50V
D25 = KT-0603R: as D61-D64 on sheet Stepper_driver_group; Package: 0603; Supplier: LC; SuppliersPartNumber: C2286; Color: Red; Manufacturer Part Number: KT-0603R; Value: 0603 Red
D26 = MHT192UGCT: as D43 on sheet Relay_Driver; Package: 0603; Supplier: LC; SuppliersPartNumber: C389519; Color: Green; Manufacturer Part Number: MHT192UGCT
D41 = LL-34 ZMM5V6-M: Single 500mW 5.2V~6V 5.6V LL-34 Zener Diodes ROHS; Manufacturer Part Number: ZMM5V6; Manufacturer: HXY MOSFET; Package: LL-34; Supplier: LC; SuppliersPartNumber: C5345993
D42 = LL-34 ZMM3V3-M: Single 3.1V~3.5V 500mW 3.3V LL-34 Zener Diodes ROHS; Manufacturer: ST(Semtech); ComponentLink1Description: 供应商链接; ComponentLink1URL: http://www.szlcsc.com/product/details_8541.html; Package: LL-34; Supplier: LC; SuppliersPartNumber: C8056; Manufacturer Part Number: ZMM3V3-M
J14 = KH-PCB-6P6C: RJ45 RJReceptacle No 1 Shrouded Without LED -45℃~+85℃ Plugin Ethernet Connectors/Modular Connectors (RJ45 RJ11) ROHS; Manufacturer: Shenzhen Kinghelm Elec; Manufacturer Part Number: KH-PCB-6P6C; SuppliersPartNumber: C2683354; Supplier: LCSC
L10 L11 = 0402 220R@100Mhz 0.1A: 700mΩ ±25% 220Ω@100MHz 0402 Ferrite Beads ROHS; Manufacturer Part Number: CBG100505U221T; Manufacturer: FH (Guangdong Fenghua Advanced Tech); Package: 0402; Supplier: LC; SuppliersPartNumber: C92617
R85 R88 = 0402 200R (2000) 1%: as R28 on sheet Neopixel_Driver; ComponentLink1Description: Supplier link; ComponentLink1URL: http://www.szlcsc.com/product/details_25830.html; Package: 0402; Supplier: LC; SuppliersPartNumber: C25087; Resistance: 200Ω; Tolerance: 1%
R86 = 0402 47K (4702) 1%: Chip resistor; Manufacturer: Uniroyal Elec; Manufacturer Part Number: 0402WGF4702TCE; Power: 1/16W; ComponentLink1Description: Supplier link; ComponentLink1URL: http://www.szlcsc.com/product/details_26535.html; Package: 0402; Supplier: LCSC; SuppliersPartNumber: C25792; Resistance: 47KΩ; Tolerance: 1%
R87 = 0805 120R (1200) 1%: Chip resistor; Manufacturer: Uniroyal Elec; Manufacturer Part Number: 0805W8F1200T5E; Power: 1/8W; ComponentLink1Description: Supplier link; ComponentLink1URL: http://www.szlcsc.com/product/details_18125.html; Package: 0805; Supplier: LCSC; SuppliersPartNumber: C17437; Tolerance: 1%
R90-R95 = 0402 2K (2001) 1%: Chip resistor; Manufacturer: Uniroyal Elec; Manufacturer Part Number: 0402WGF2001TCE; Power: 1/16W; ComponentLink1Description: Supplier link; ComponentLink1URL: http://www.szlcsc.com/product/details_4516.html; Package: 0402; Supplier: LC; SuppliersPartNumber: C4109; Resistance: 2KΩ; Tolerance: 1%
U18 = CBMuD1201LAS8: Dual Channel Isolator; Manufacturer: Corebai Microelectronics; Package: SOIC-8_150mil; Supplier: LC; SuppliersPartNumber: C476472; ComponentLink1Description: 供应商链接; ComponentLink1URL: http://www.szlcsc.com/product/details_10199.html; Manufacturer Part Number: CBMuD1201LAS8
U19 = CAN/PCA82C250T/YM_[C7439]: CAN; Manufacturer Part Number: PCA82C250T/YM,118; Manufacturer: NXP Semicon; ComponentLink1Description: 供应商链接; ComponentLink1URL: http://www.szlcsc.com/product/details_7916.html; Package: SOIC-8_150mil; Supplier: LCSC; SuppliersPartNumber: C7439
U21 U22 = EL357N(B)(TA)-G_[C6649]: as U29 on sheet External_Stepper; Package: SOP-4_P2.54; Supplier: LC; SuppliersPartNumber: C6649; Manufacturer: Everlight; Manufacturer Part Number: EL357N(B)(TA)-G

## Sheet Change Log.SchDoc: Sienci Longboard Ext
size B; Author: AM; CompanyName: Expatria Technologies; DrawnBy: A.Marles; Engineer: AM; Organization: Expatria Technolgoies; Address1: PO Box 2084; Address3: Merritt, BC V1K 1B8; Address4: Canada; DocumentNumber: 27; Revision: B9; SheetNumber: 27; SheetTotal: 27
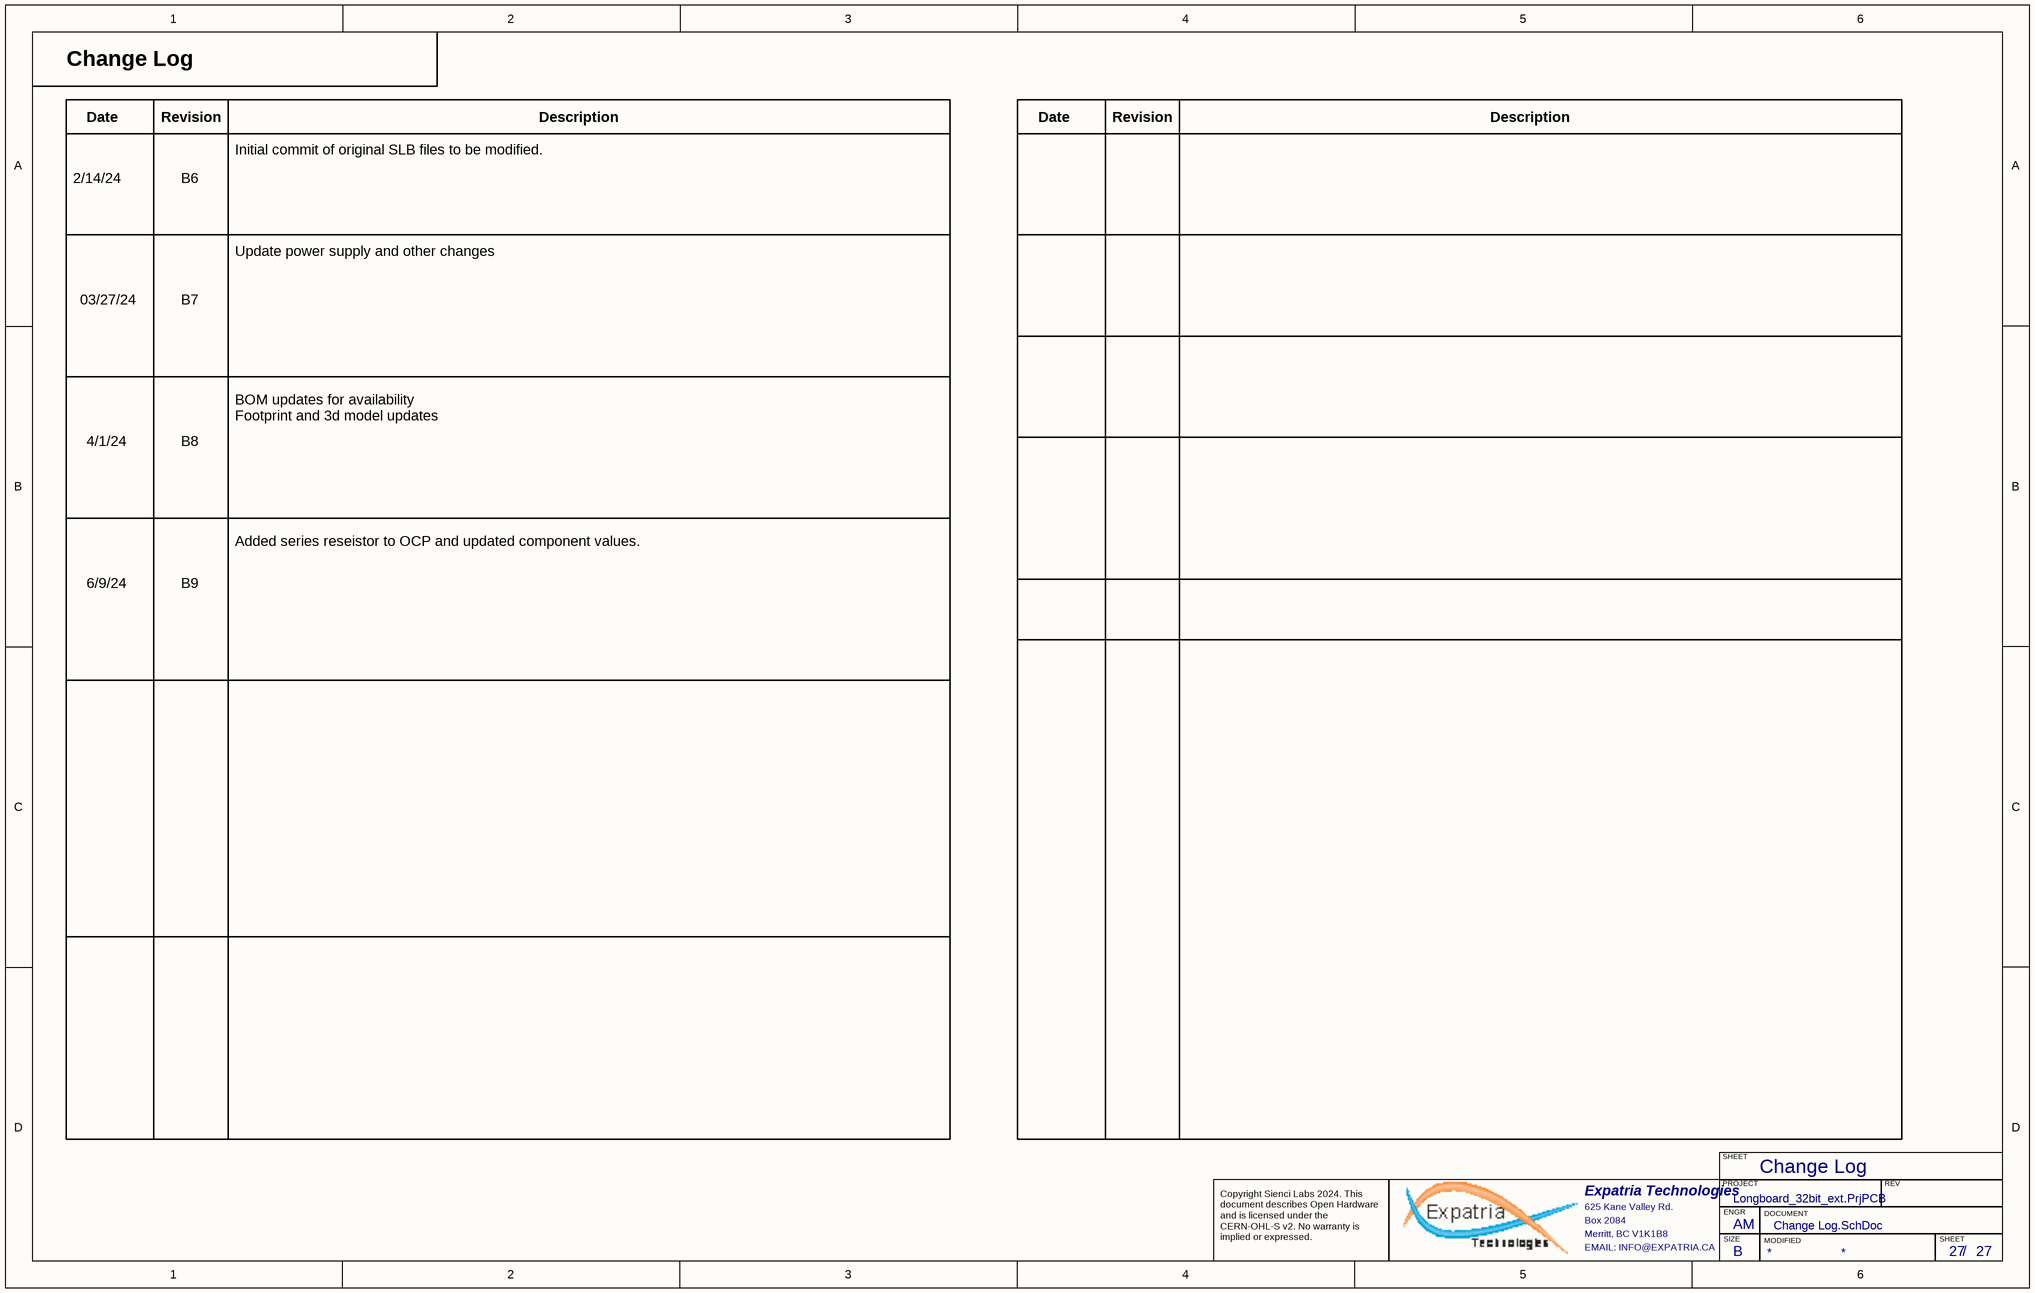
[diagram p25: Change Log.SchDoc]

### Notes on the sheet
- Change Log
- Date
- Revision
- Description
- 2/14/24
- B6
- Initial commit of original SLB files to be modified.
- 03/27/24
- B7
- Update power supply and other changes
- 4/1/24
- B8
- BOM updates for availability
  Footprint and 3d model updates
- 6/9/24
- B9
- Added series reseistor to OCP and updated component values.
- SHEET
- Expatria Technologies
- 625 Kane Valley Rd.
- Box 2084
- Merritt, BC V1K1B8
- PROJECT
- SIZE
- ENGR
- MODIFIED
- DOCUMENT
- REV
- Copyright Sienci Labs 2024. This document describes Open Hardware and is licensed under the CERN-OHL-S v2. No warranty is implied or expressed.
- EMAIL: INFO@EXPATRIA.CA
- B
- /

## Sheet USB_Connector.SchDoc: RP2040 CNC
size B; Author: AM; CompanyName: Expatria Technologies; DrawnBy: A.Marles; Engineer: AM; Organization: Expatria Technolgoies; Address1: PO Box 2084; Address3: Merritt, BC V1K 1B8; Address4: Canada; DocumentNumber: 25; Revision: B9; SheetNumber: 25; SheetTotal: 27
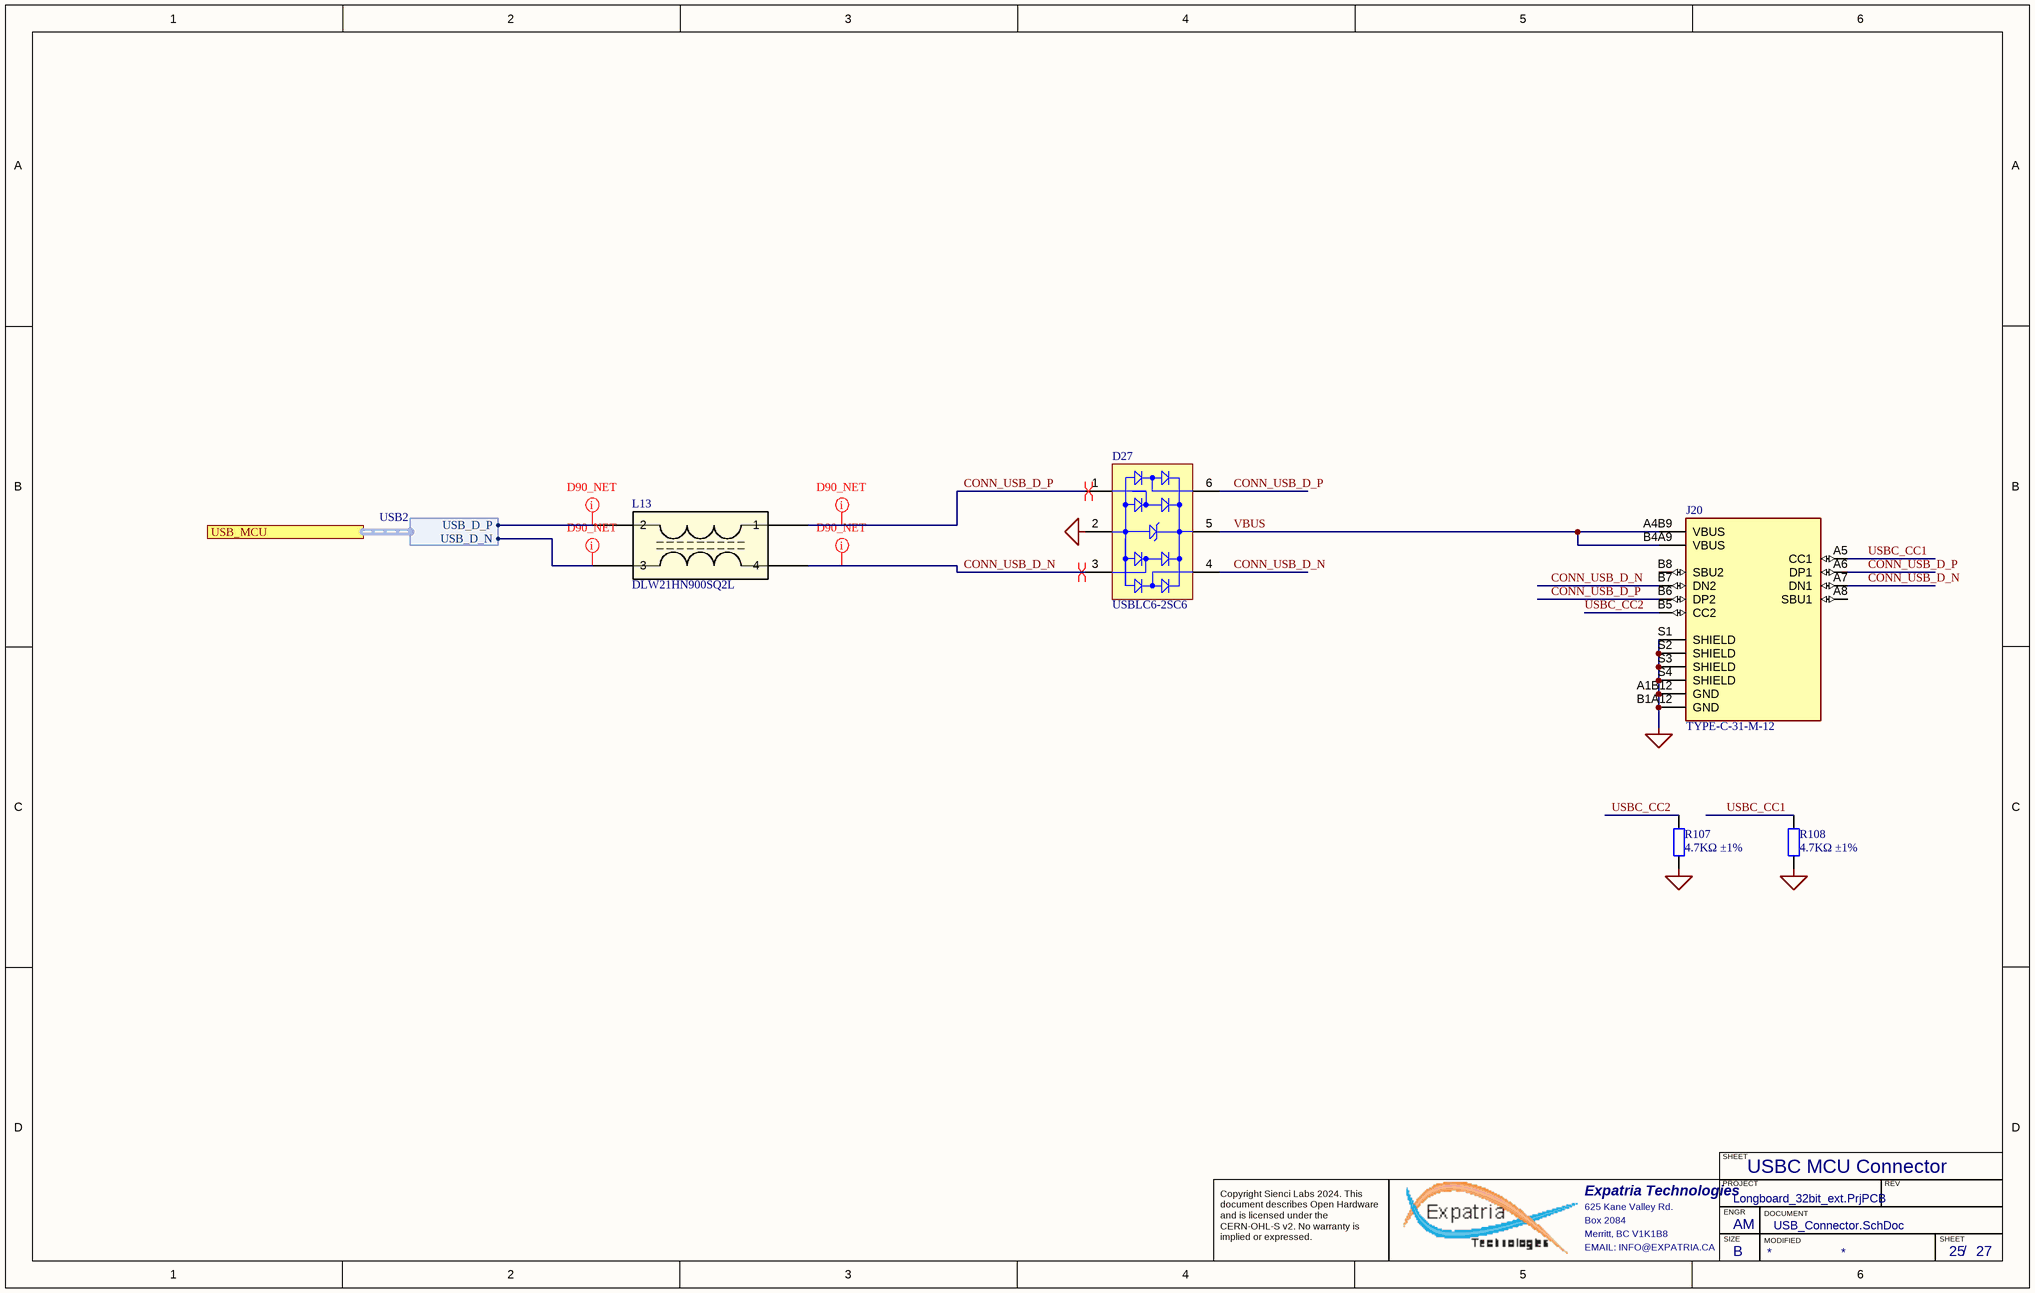
[diagram p26: USB_Connector.SchDoc]

### Parts
D27  USBLC6-2SC6  [SOT95P280X145-6N]
J20  TYPE-C-31-M-12  [HRO_TYPE-C-31-M-12]
L13  DLW21HN900SQ2L  [DLW21HN121HQ2B]
R107  4.7KΩ ±1%  [0603_R]
R108  4.7KΩ ±1%  [0603_R]

### Ports
USB_MCU (harness USB2)

### Harnesses
USB2: USB_D_P, USB_D_N

### Nets
MCU_GND: D27.2(GND) J20.A1B12(GND) J20.B1A12(GND) J20.S1(SHIELD) J20.S2(SHIELD) J20.S3(SHIELD) J20.S4(SHIELD) R107.2 R108.2
CONN_USB_D_N: D27.3(I/O_2) D27.4(I/O_3) J20.A7(DN1) J20.B7(DN2) L13.4
CONN_USB_D_P: D27.1(I/O_1) D27.6(I/O_4) J20.A6(DP1) J20.B6(DP2) L13.1
USB_D_N: L13.3 ; port USB_MCU.USB_D_N
USB_D_P: L13.2 ; port USB_MCU.USB_D_P
USBC_CC1: J20.A5(CC1) R108.1
USBC_CC2: J20.B5(CC2) R107.1
VBUS: D27.5(VBUS) J20.A4B9(VBUS) J20.B4A9(VBUS)

Not connected (* = marked no-connect by the designer): J20 A8(SBU1) B8(SBU2)

### Layout directives
differential pair: CONN_USB_D_N, CONN_USB_D_P
net class D90_NET: CONN_USB_D_N, CONN_USB_D_P, USB_D_N, USB_D_P

### Notes on the sheet
- USBC MCU Connector
- SHEET
- Expatria Technologies
- 625 Kane Valley Rd.
- Box 2084
- Merritt, BC V1K1B8
- PROJECT
- SIZE
- ENGR
- MODIFIED
- DOCUMENT
- REV
- Copyright Sienci Labs 2024. This document describes Open Hardware and is licensed under the CERN-OHL-S v2. No warranty is implied or expressed.
- EMAIL: INFO@EXPATRIA.CA
- B
- /

### Library data of the parts
D27 = USBLC6-2SC6: Very low capacitance ESD protection, 3.5 pF, -40 to 125 degC, 6-Pin SOT23, RoHS, Tape and Reel; Manufacturer: TECH PUBLIC; Polarity: Uni-Directional; Clamping Voltage: 11V; Rad Hardened: No; Product Height (mm): 1.3mm; Leakage Current (Max): 0.15uA; Product Length (mm): 3.05mm; Number of Elements: 1; Peak Pulse Current: 5A; Configuration: Dual; Reverse Breakdown Voltage: 6V; Working Voltage (Max): 5V; Capacitance Value: 3.5pF; Suppressor Type: DiodeArrays; Product Depth (mm): 1.75mm; Test Current (It): 1mA; Package / Case: SOT-23; Operating Temperature Max Deg. C: 125C; Package Description: 6-Pin Small Outline Transistor, Body 2.925 x 1.625 mm, Pitch 0.95 mm; Package Reference: SOT23-6L; Operating Temperature Min Deg. C: -40C; Mounting Style: SurfaceMount; Direction Type: Uni-Directional; Mounting: SurfaceMount; Pin Count: 6; Leakage Current: 0.15uA; Packaging: TapeandReel; Operating Temperature Classification: Automotive; Clamping Voltage (Max): 11V; Reverse Stand-off Voltage: 5V; Datasheet URL: http://www.st.com/st-web-ui/static/active/en/resource/technical/document/datasheet/CD00050750.pdf; Working Voltage: 5V; Operating Temp Range: -40Cto125C; Manufacturer Part Number: USBLC6-2SC6; SuppliersPartNumber: C2827654; Supplier: LCSC
J20 = TYPE-C-31-M-12: USB Connectors 24 Receptacle 1 8.94*7.3mm RoHS; Manufacturer: HRO Electronics Co., Ltd.; Value: TYPE-C-31-M-12; SnapEDA_Link: https://www.snapeda.com/parts/TYPE-C-31-M-12/HRO%20Electronics%20Co.,%20Ltd./view-part/3228496/?ref=snap; Package: Package; Manufacturer Part Number: TYPE-C-31-M-12; SuppliersPartNumber: C2765186; Supplier: LCSC
L13 = DLW21HN900SQ2L: 90Ω@100MHz -40℃~+85℃ 350mΩ 50V 2 330mA 125V SMD-4P Common Mode Filters ROHS; Manufacturer: Murata Electronics; SuppliersPartNumber: C80529; Manufacturer Part Number: DLW21HN900SQ2L; Supplier: LCSC; Value: DLW21HN900SQ2L
R107 R108 = 0603 4.7K (4701) 1%: Chip resistor; Manufacturer: Uniroyal Elec; Manufacturer Part Number: 0603WAF4701T5E; Power: 1/10W; ComponentLink1Description: Supplier link; ComponentLink1URL: http://www.szlcsc.com/product/details_23889.html; Package: 0603; Supplier: LCSC; SuppliersPartNumber: C23162; Resistance: 4.7KΩ; Tolerance: 1%

## Sheet Board_Diagram.SchDoc: STM32F412 CNC
size B; Author: AM; CompanyName: Expatria Technologies; DrawnBy: A.Marles; Engineer: AM; Organization: Expatria Technolgoies; Address1: PO Box 2084; Address3: Merritt, BC V1K 1B8; Address4: Canada; DocumentNumber: 2; Revision: B9; SheetNumber: 2; SheetTotal: 27
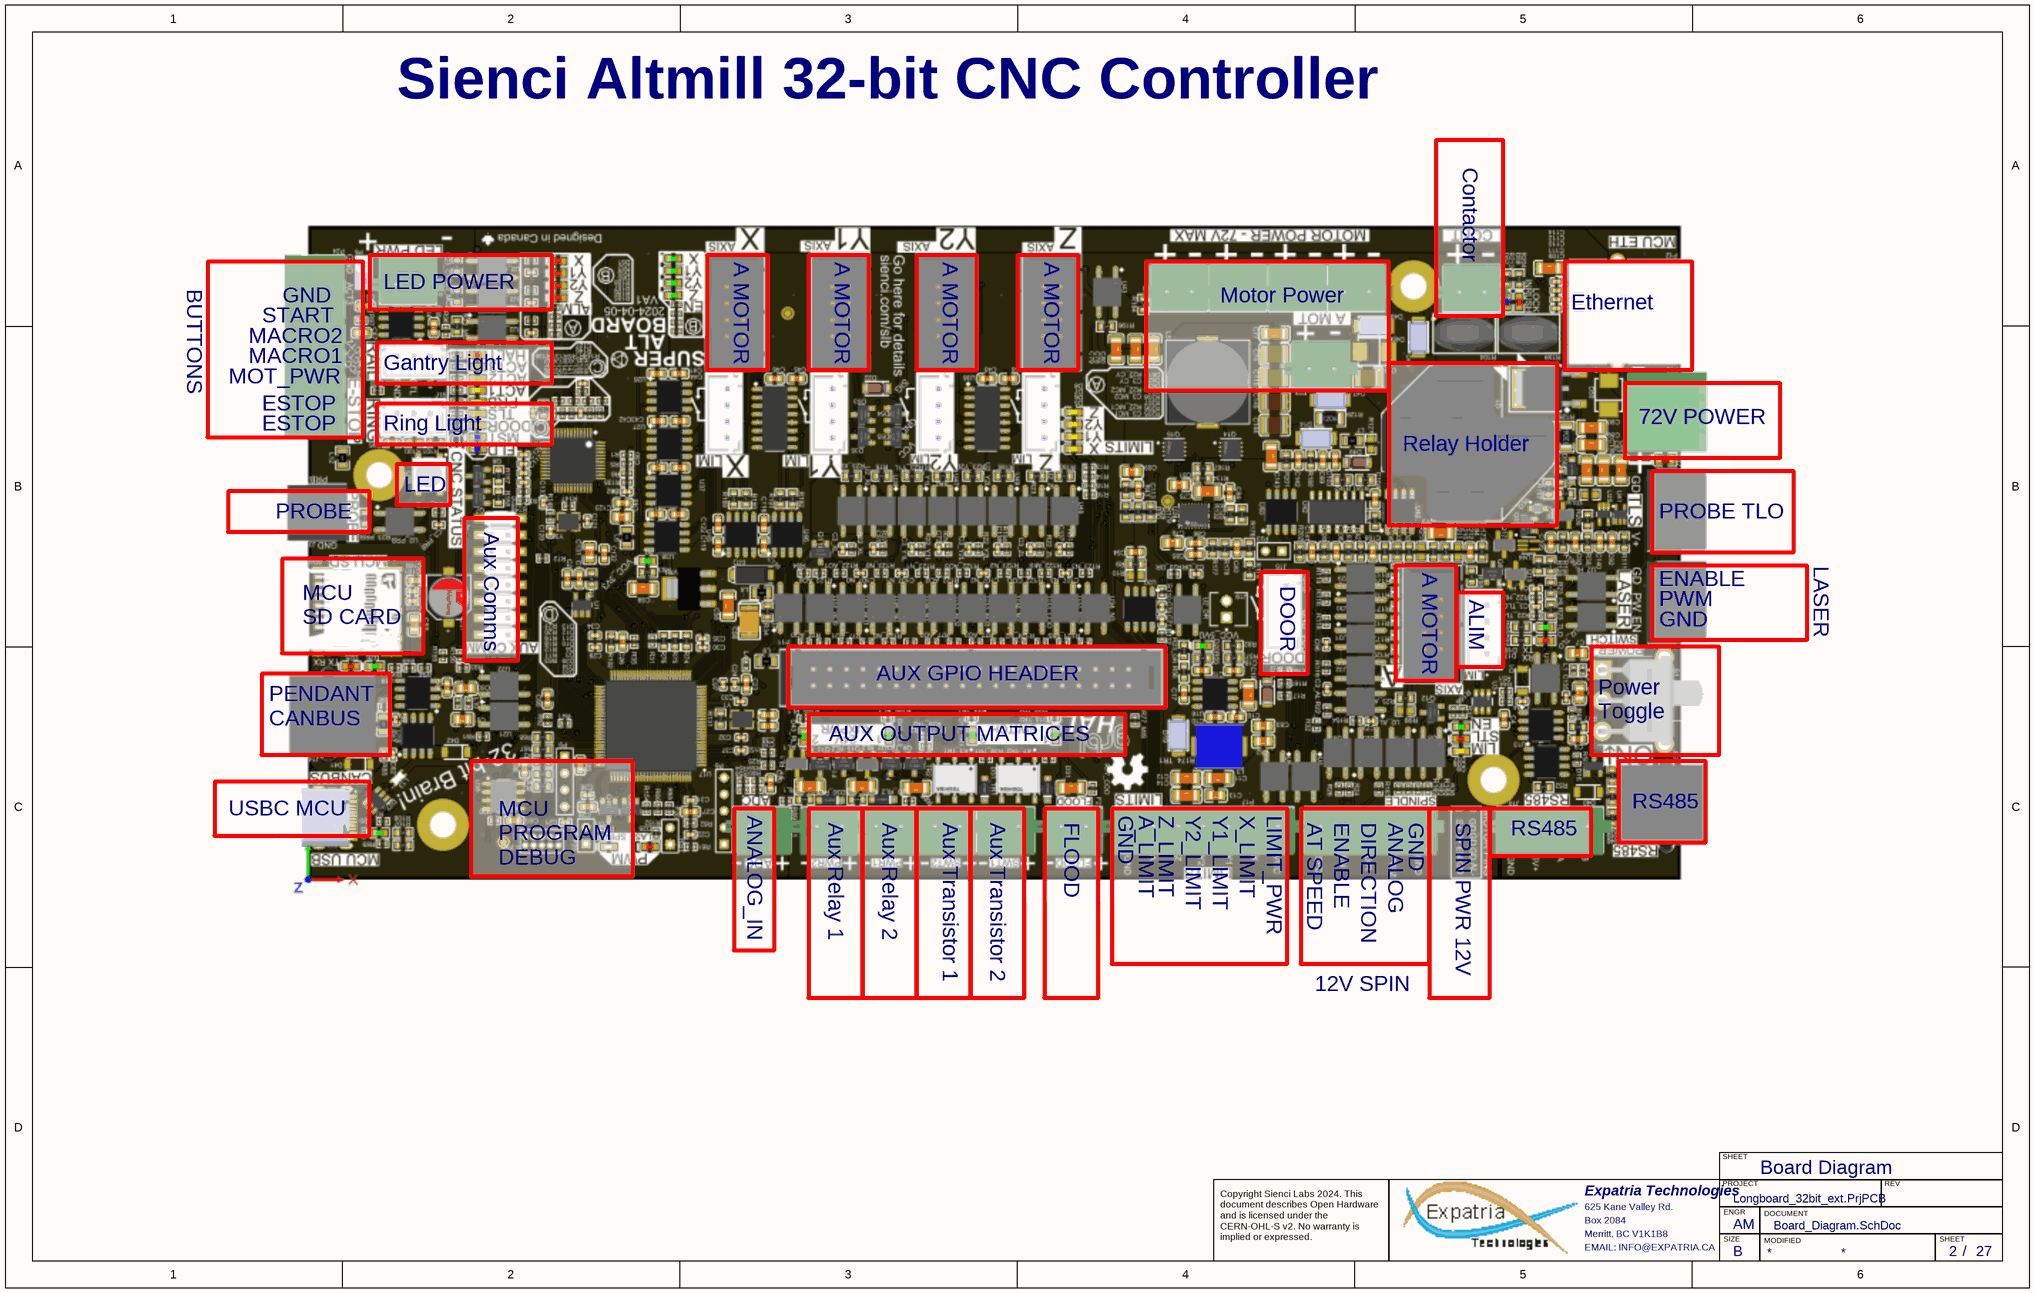
[diagram p27: Board_Diagram.SchDoc]

### Notes on the sheet
- Sienci Altmill 32-bit CNC Controller
- Contactor
- BUTTONS
- LED POWER
- A MOTOR
- MACRO1
- MACRO2
- START
- GND
- Gantry Light
- Motor Power
- Ethernet
- MOT_PWR
- ESTOP
- Ring Light
- 72V POWER
- LED
- Relay Holder
- PROBE
- Aux Comms
- PROBE TLO
- LASER
- DOOR
- ALIM
- PWM
- ENABLE
- MCU
  SD CARD
- AUX GPIO HEADER
- PENDANT
  CANBUS
- AUX OUTPUT MATRICES
- Power
  Toggle
- USBC MCU
- ANALOG_IN
- Aux Relay 1
- Aux Relay 2
- Aux Transistor 1
- Aux Transistor 2
- FLOOD
- A_LIMIT
- Z_LIMIT
- Y2_LIMIT
- Y1_LIMIT
- X_LIMIT
- LIMIT_PWR
- AT SPEED
- DIRECTION
- ANALOG
- SPIN PWR 12V
- RS485
- MCU PROGRAM
  DEBUG
- 12V SPIN
- Board Diagram
- SHEET
- Expatria Technologies
- 625 Kane Valley Rd.
- Box 2084
- Merritt, BC V1K1B8
- PROJECT
- SIZE
- ENGR
- MODIFIED
- DOCUMENT
- REV
- Copyright Sienci Labs 2024. This document describes Open Hardware and is licensed under the CERN-OHL-S v2. No warranty is implied or expressed.
- EMAIL: INFO@EXPATRIA.CA
- B
- /